# EAGLE design Capstone-Main (EAGLE 9.3.1)
DRAWING_AUTHOR: S.Spencer & E.Fryters; DRAWING_NUMBER: DWG-001; REV: A

## Sheet 1 of 5: MCU Microcontroller specific circuitry
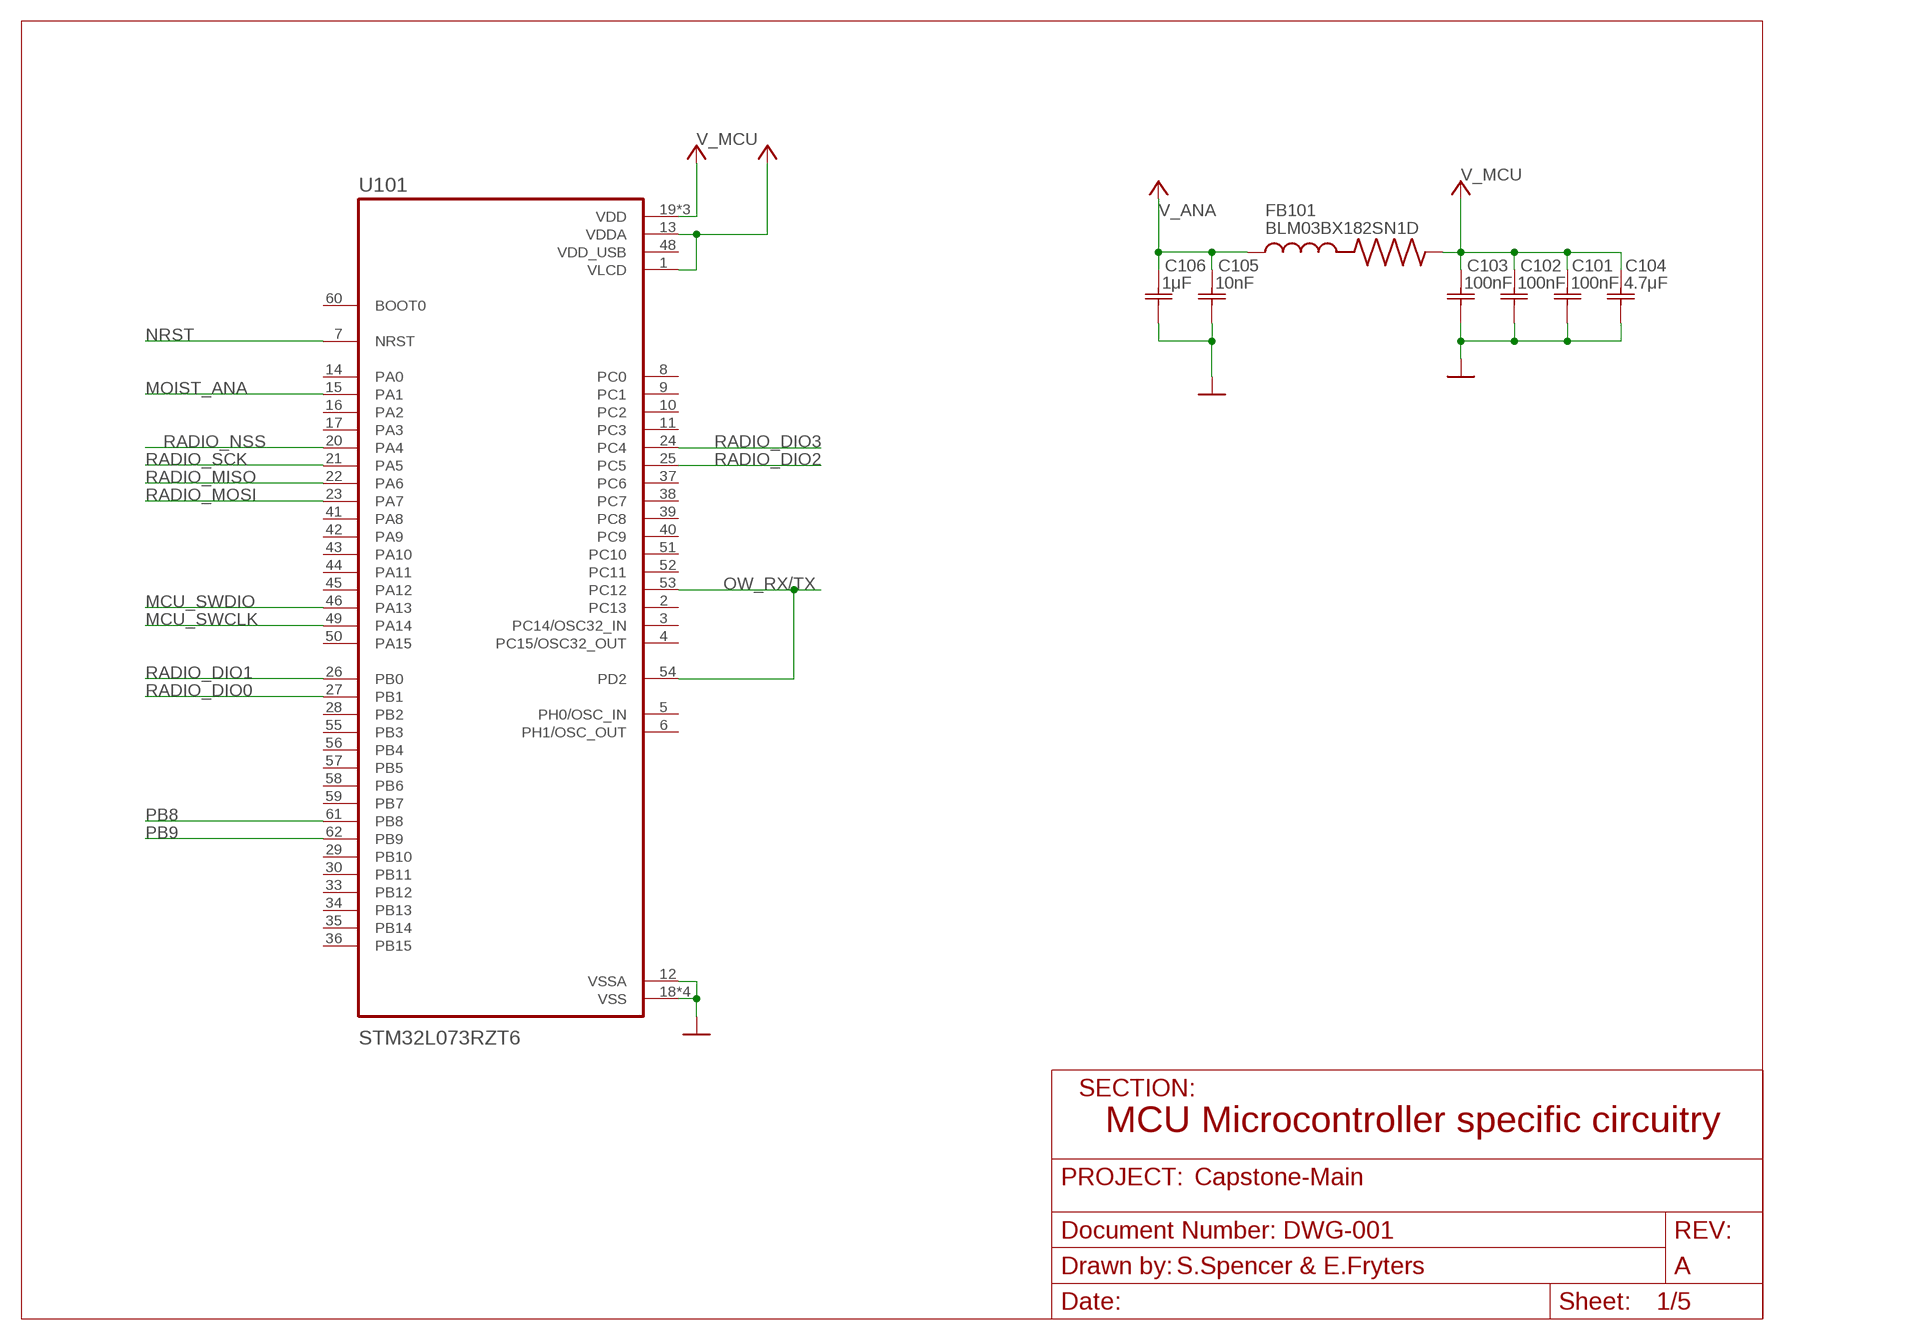
[diagram p0: schematic, sheet 1]

### Parts
C101  100nF  GRM188R71H104KA93D  [CAPC1608X85N]
C102  100nF  GRM188R71H104KA93D  [CAPC1608X85N]
C103  100nF  GRM188R71H104KA93D  [CAPC1608X85N]
C104  4.7μF  GRM188R71H104KA93D  [CAPC1608X85N]
C105  10nF  GRM188R71H104KA93D  [CAPC1608X85N]
C106  1μF  GRM188R71H104KA93D  [CAPC1608X85N]
FB101  BLM03BX182SN1D  [BEADC0603X33N]
U101  STM32L073RZT6  [QFP50P1200X1200X160-64N]

### Nets
GND: C101.1(C1) C102.1(C1) C103.1(C1) C104.1(C1) C105.1(C1) C106.1(C1) U101.12(VSSA) U101.18(VSS) U101.31(VSS) U101.47(VSS) U101.63(VSS) ; also sheet 2,3,4,5
MCU_SWCLK: U101.49(PA14) ; also sheet 4
MCU_SWDIO: U101.46(PA13) ; also sheet 4
MOIST_ANA: U101.15(PA1) ; also sheet 4
NRST: U101.7(NRST) ; also sheet 4
OW_RX/TX: U101.53(PC12) U101.54(PD2) ; also sheet 4
PB8: U101.61(PB8) ; also sheet 4
PB9: U101.62(PB9) ; also sheet 4
RADIO_DIO0: U101.27(PB1) ; also sheet 2
RADIO_DIO1: U101.26(PB0) ; also sheet 2
RADIO_DIO2: U101.25(PC5) ; also sheet 2
RADIO_DIO3: U101.24(PC4) ; also sheet 2
RADIO_MISO: U101.22(PA6) ; also sheet 2
RADIO_MOSI: U101.23(PA7) ; also sheet 2
RADIO_NSS: U101.20(PA4) ; also sheet 2
RADIO_SCK: U101.21(PA5) ; also sheet 2
V_ANA: C105.2(C2) C106.2(C2) FB101.1 U101.1(VLCD) U101.13(VDDA) ; supply symbol labelled VCC
V_MCU: C101.2(C2) C102.2(C2) C103.2(C2) C104.2(C2) FB101.2 U101.19(VDD) U101.32(VDD) U101.64(VDD) ; supply symbol labelled V_3.3, VCC ; also sheet 2,3,4
Unconnected: U101.2(PC13) U101.3(PC14/OSC32_IN) U101.4(PC15/OSC32_OUT) U101.5(PH0/OSC_IN) U101.6(PH1/OSC_OUT) U101.8(PC0) U101.9(PC1) U101.10(PC2) U101.11(PC3) U101.14(PA0) U101.16(PA2) U101.17(PA3) U101.28(PB2) U101.29(PB10) U101.30(PB11) U101.33(PB12) U101.34(PB13) U101.35(PB14) U101.36(PB15) U101.37(PC6) U101.38(PC7) U101.39(PC8) U101.40(PC9) U101.41(PA8) U101.42(PA9) U101.43(PA10) U101.44(PA11) U101.45(PA12) U101.50(PA15) U101.51(PC10) U101.52(PC11) U101.55(PB3) U101.56(PB4) U101.57(PB5) U101.58(PB6) U101.59(PB7) U101.60(BOOT0)

## Sheet 2 of 5: SX1272 / Radio Radio circuitry here
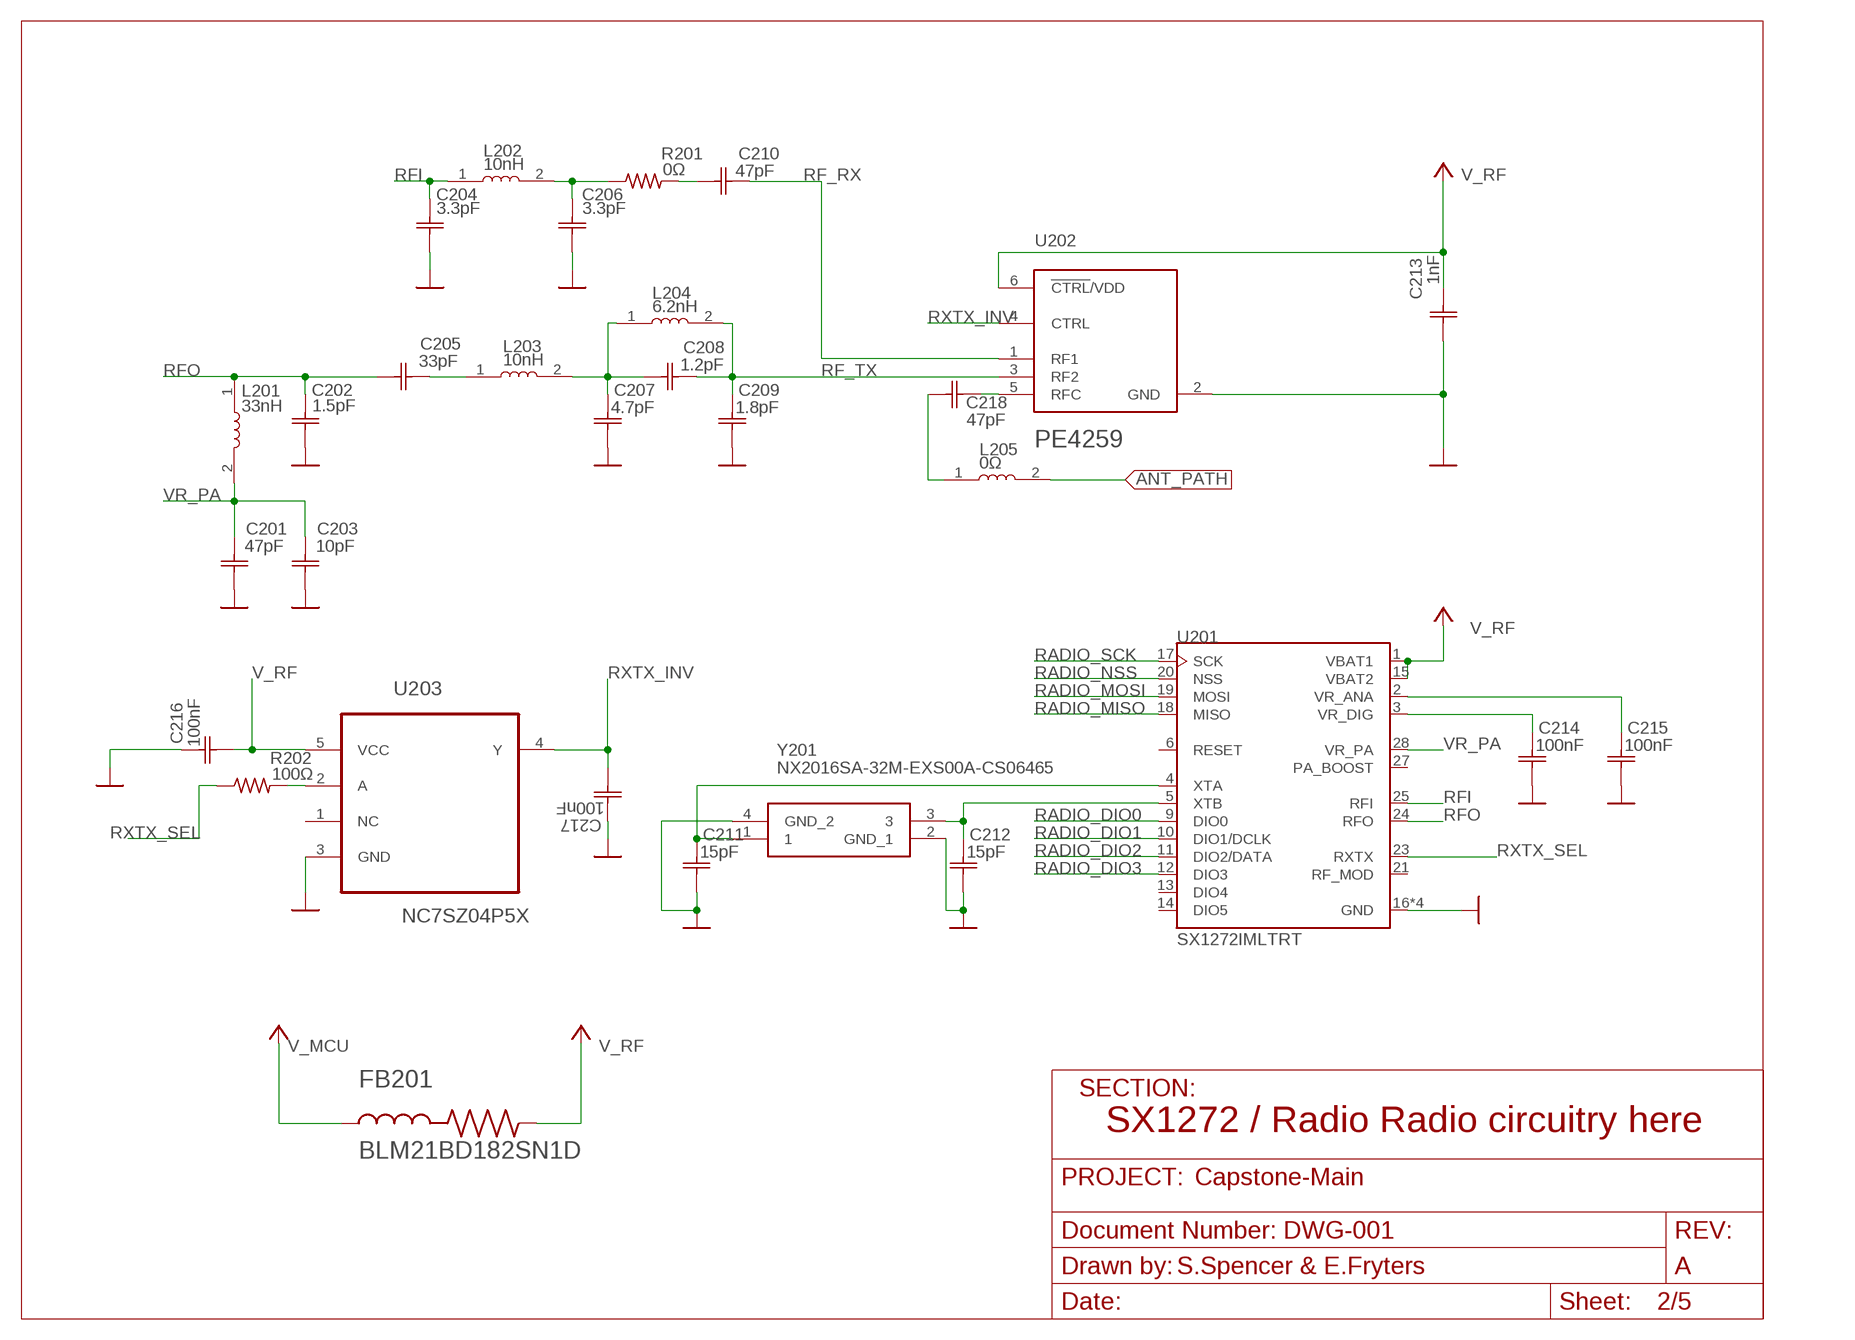
[diagram p1: schematic, sheet 2]

### Parts
C201  47pF  GRM188R71H104KA93D  [CAPC1608X85N]
C202  1.5pF  GRM188R71H104KA93D  [CAPC1608X85N]
C203  10pF  GRM188R71H104KA93D  [CAPC1608X85N]
C204  3.3pF  GRM188R71H104KA93D  [CAPC1608X85N]
C205  33pF  GRM188R71H104KA93D  [CAPC1608X85N]
C206  3.3pF  GRM188R71H104KA93D  [CAPC1608X85N]
C207  4.7pF  GRM188R71H104KA93D  [CAPC1608X85N]
C208  1.2pF  GRM188R71H104KA93D  [CAPC1608X85N]
C209  1.8pF  GRM188R71H104KA93D  [CAPC1608X85N]
C210  47pF  GRM188R71H104KA93D  [CAPC1608X85N]
C211  15pF  GRM188R71H104KA93D  [CAPC1608X85N]
C212  15pF  GRM188R71H104KA93D  [CAPC1608X85N]
C213  1nF  GRM188R71H104KA93D  [CAPC1608X85N]
C214  100nF  GRM188R71H104KA93D  [CAPC1608X85N]
C215  100nF  GRM188R71H104KA93D  [CAPC1608X85N]
C216  100nF  GRM188R71H104KA93D  [CAPC1608X85N]
C217  100nF  GRM188R71H104KA93D  [CAPC1608X85N]
C218  47pF  GRM188R71H104KA93D  [CAPC1608X85N]
FB201  BLM21BD182SN1D  [BEADC2012X105N]
L201  33nH  LQP03TG1N0C02D  [INDC1608X95]
L202  10nH  LQP03TG1N0C02D  [INDC1608X95]
L203  10nH  LQP03TG1N0C02D  [INDC1608X95]
L204  6.2nH  LQP03TG1N0C02D  [INDC1608X95]
L205  0Ω  LQP03TG1N0C02D  [INDC1608X95]
R201  0Ω  R-US_R0603  [R0603]
R202  100Ω  R-US_R0603  [R0603]
U201  SX1272IMLTRT  [QFN65P600X600X100-29N]
U202  PEREGRINE_SEMICONDUCTOR_PE4259PEREGRINE_SEMICONDUCTOR_PE4259_0_0  [PEREGRINE_SEMICONDUCTOR_PE4259_0]
U203  NC7SZ04P5X  [SOT65P210X110-5N]
Y201  NX2016SA-32M-EXS00A-CS06465  [NX2016SA32MEXS00ACS06465]

### Nets
ANT_PATH: L205.2 ; also sheet 5
GND: C201.1(C1) C202.2(C2) C203.1(C1) C204.2(C2) C206.2(C2) C207.2(C2) C209.2(C2) C211.2(C2) C212.2(C2) C213.2(C2) C214.2(C2) C215.2(C2) C216.1(C1) C217.1(C1) U201.16(GND) U201.22(GND) U201.26(GND) U201.29(GND) U202.2(GND) U203.3(GND) Y201.2(GND_1) Y201.4(GND_2) ; also sheet 1,3,4,5
N$1: C214.1(C1) U201.3(VR_DIG)
N$2: C215.1(C1) U201.2(VR_ANA)
N$3: C211.1(C1) U201.4(XTA) Y201.1
N$5: C206.1(C1) L202.2 R201.1
N$7: C210.2(C2) R201.2
N$10: C212.1(C1) U201.5(XTB) Y201.3
N$14: C205.1(C1) L203.1
N$15: C207.1(C1) C208.1(C1) L203.2 L204.1
N$19: R202.2 U203.2(A)
N$20: C218.2(C2) U202.5(RFC)
N$21: C218.1(C1) L205.1
RADIO_DIO0: U201.9(DIO0) ; also sheet 1
RADIO_DIO1: U201.10(DIO1/DCLK) ; also sheet 1
RADIO_DIO2: U201.11(DIO2/DATA) ; also sheet 1
RADIO_DIO3: U201.12(DIO3) ; also sheet 1
RADIO_MISO: U201.18(MISO) ; also sheet 1
RADIO_MOSI: U201.19(MOSI) ; also sheet 1
RADIO_NSS: U201.20(NSS) ; also sheet 1
RADIO_SCK: U201.17(SCK) ; also sheet 1
RF_RX: C210.1(C1) U202.1(RF1)
RF_TX: C208.2(C2) C209.1(C1) L204.2 U202.3(RF2)
RFI: C204.1(C1) L202.1 U201.25(RFI)
RFO: C202.1(C1) C205.2(C2) L201.1 U201.24(RFO)
RXTX_INV: C217.2(C2) U202.4(CTRL) U203.4(Y)
RXTX_SEL: R202.1 U201.23(RXTX)
V_MCU: FB201.1 ; supply symbol labelled VCC ; also sheet 1,3,4
V_RF: C213.1(C1) C216.2(C2) FB201.2 U201.1(VBAT1) U201.15(VBAT2) U202.6(!CTRL!/VDD) U203.5(VCC) ; supply symbol labelled VCC
VR_PA: C201.2(C2) C203.2(C2) L201.2 U201.28(VR_PA)
Unconnected: U201.6(RESET) U201.13(DIO4) U201.14(DIO5) U201.21(RF_MOD) U201.27(PA_BOOST) U203.1(NC)

## Sheet 3 of 5: Power Circuitry to handle power and power distribution
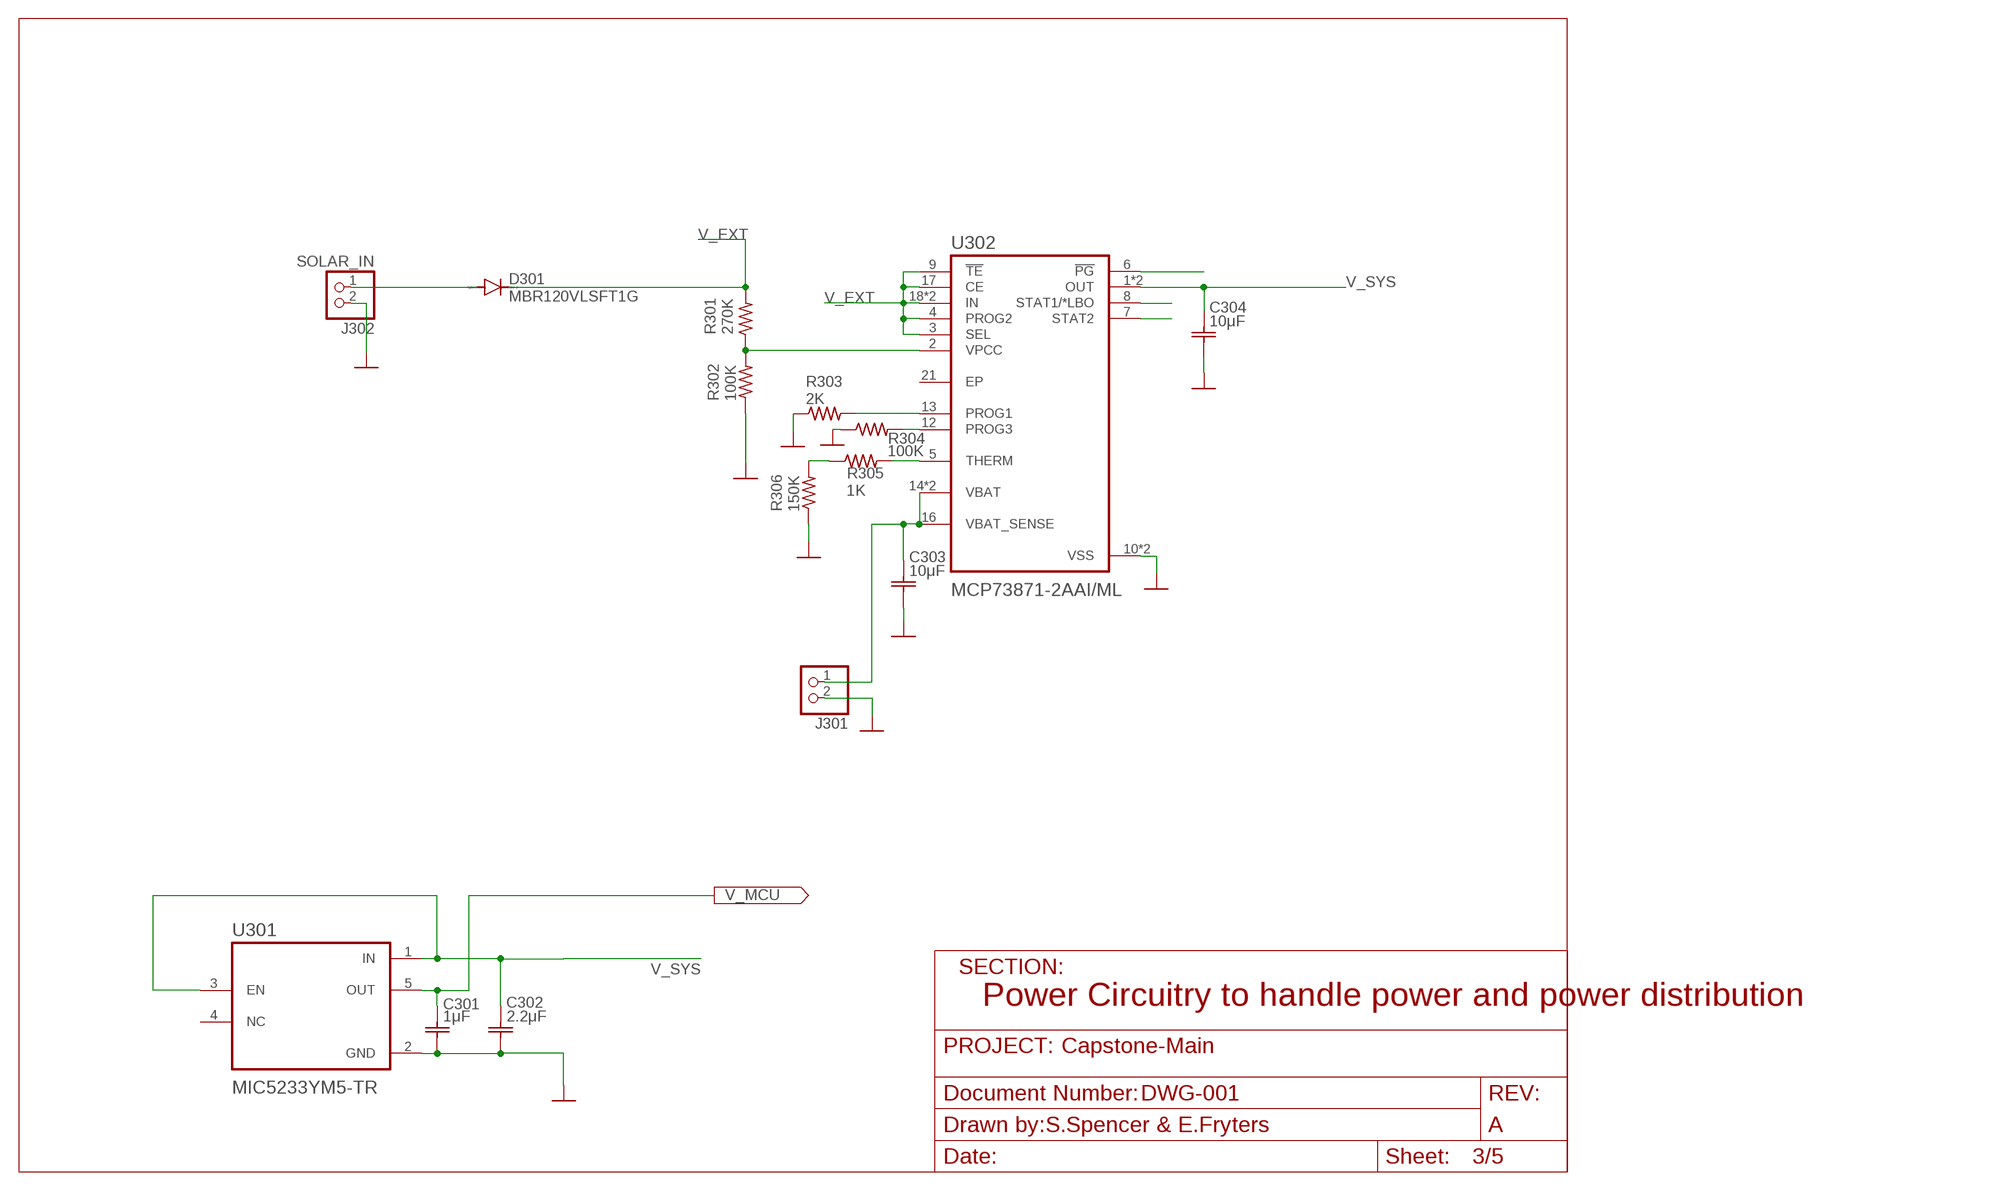
[diagram p2: schematic, sheet 3]

### Parts
C301  1μF  GRM188R71H104KA93D  [CAPC1608X85N]
C302  2.2μF  GRM188R71H104KA93D  [CAPC1608X85N]
C303  10μF  GRM188R71H104KA93D  [CAPC1608X85N]
C304  10μF  GRM188R71H104KA93D  [CAPC1608X85N]
D301  MBR120VLSFT1G  CGRM4001-G  [SOD-123_MINI-SMA]
J301  JST_2PIN-SMT-RA  [JST-PH-2-SMT-RA]
J302  SOLAR_IN  JST_2PIN-SMT-RA  [JST-PH-2-SMT-RA]
R301  270K  R-US_R0603  [R0603]
R302  100K  R-US_R0603  [R0603]
R303  2K  R-US_R0603  [R0603]
R304  100K  R-US_R0603  [R0603]
R305  1K  R-US_R0603  [R0603]
R306  150K  R-US_R0603  [R0603]
U301  MIC5233YM5-TR  [SOT95P280X145-5N]
U302  MCP73871-2AAI/ML  [QFN50P400X400X100-21N]

### Nets
GND: C301.2(C2) C302.2(C2) C303.2(C2) C304.2(C2) J301.2 J302.2 R302.1 R303.1 R304.1 R306.1 U301.2(GND) U302.10(VSS) U302.11(VSS) ; also sheet 1,2,4,5
N$4: R301.1 R302.2 U302.2(VPCC)
N$6: R304.2 U302.12(PROG3)
N$8: R303.2 U302.13(PROG1)
N$11: C303.1(C1) J301.1 U302.14(VBAT) U302.15(VBAT) U302.16(VBAT_SENSE)
N$12: R305.1 R306.2
N$13: R305.2 U302.5(THERM)
N$16: U302.6(!PG)
N$17: U302.8(STAT1/*LBO)
N$18: U302.7(STAT2)
N$23: D301.A J302.1
V_EXT: D301.C R301.2 U302.3(SEL) U302.4(PROG2) U302.9(!TE) U302.17(CE) U302.18(IN) U302.19(IN) ; also sheet 4
V_MCU: C301.1(C1) U301.5(OUT) ; also sheet 1,2,4
V_SYS: C302.1(C1) C304.1(C1) U301.1(IN) U301.3(EN) U302.1(OUT) U302.20(OUT)
Unconnected: U301.4(NC) U302.21(EP)

## Sheet 4 of 5: Mechanical / Connectors Contains all connector revelant symbols</p?
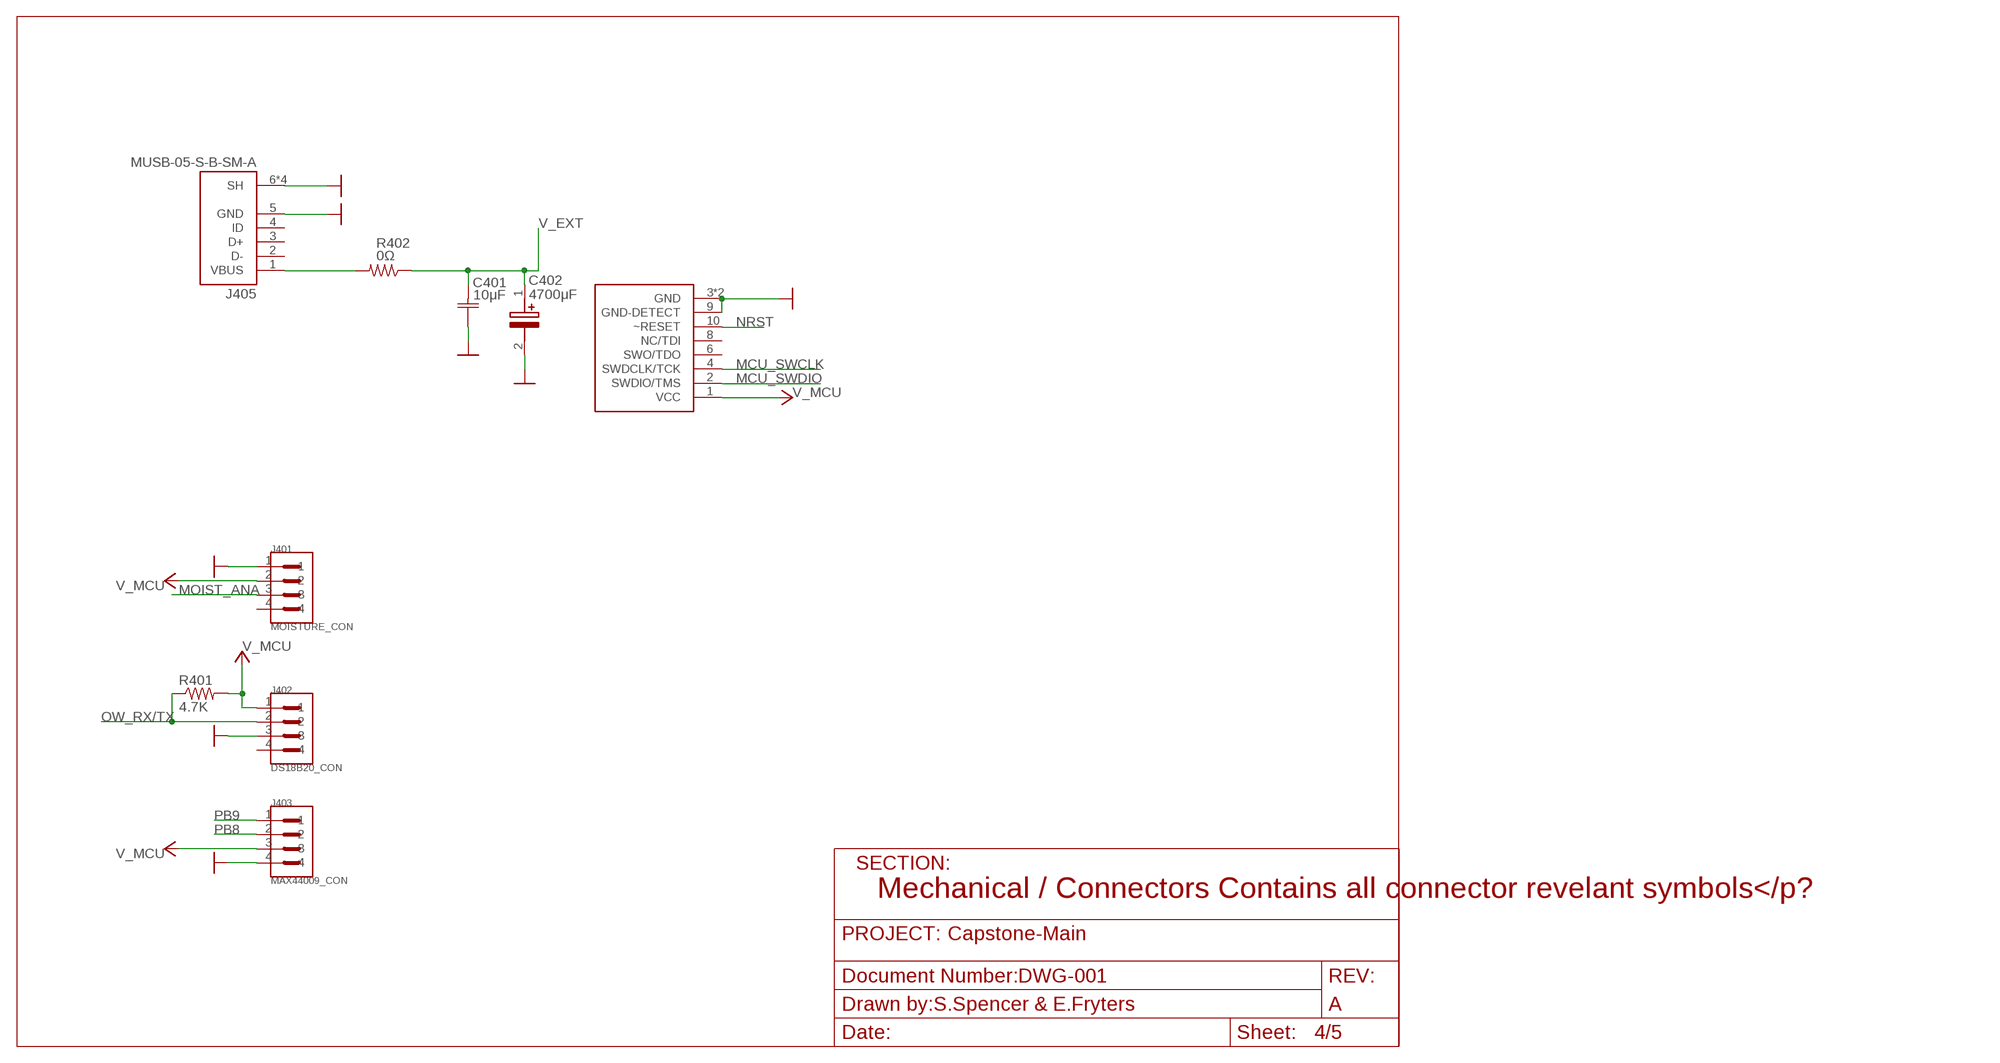
[diagram p3: schematic, sheet 4]

### Parts
C401  10μF  GRM188R71H103KA01D  [CAPC1608X85N]
C402  4700μF  EEV-FK1A472M  [CAPAE1700X1700N]
J401  MOISTURE_CON  B4B-PH-SM4-TB  [JST_B4B-PH-SM4-TB]
J402  DS18B20_CON  B4B-PH-SM4-TB  [JST_B4B-PH-SM4-TB]
J403  MAX44009_CON  B4B-PH-SM4-TB  [JST_B4B-PH-SM4-TB]
J404  2X5_0.05"_CORTEX_DEBUGSMD_SHROUDED  [2X5_0.05"_SMD_SH]
J405  MUSB-05-S-B-SM-A  [SAMTEC_MUSB-05-S-B-SM-A]
R401  4.7K  R-US_R0603  [R0603]
R402  0Ω  R-US_R0603  [R0603]

### Nets
GND: C401.1(C1) C402.2(-) J401.1 J402.3 J403.4 J404.3(GND) J404.5(GND) J404.9(GND-DETECT) J405.5(GND) J405.6(SH) J405.7(SH) J405.8(SH) J405.9(SH) ; also sheet 1,2,3,5
MCU_SWCLK: J404.4(SWDCLK/TCK) ; also sheet 1
MCU_SWDIO: J404.2(SWDIO/TMS) ; also sheet 1
MOIST_ANA: J401.3 ; also sheet 1
N$9: J405.1(VBUS) R402.2
NRST: J404.10(~RESET) ; also sheet 1
OW_RX/TX: J402.2 R401.1 ; also sheet 1
PB8: J403.2 ; also sheet 1
PB9: J403.1 ; also sheet 1
V_EXT: C401.2(C2) C402.1(+) R402.1 ; also sheet 3
V_MCU: J401.2 J402.1 J403.3 J404.1(VCC) R401.2 ; supply symbol labelled VCC ; also sheet 1,2,3
Unconnected: J401.4 J402.4 J404.6(SWO/TDO) J404.8(NC/TDI) J405.2(D-) J405.3(D+) J405.4(ID)

## Sheet 5 of 5: Antenna
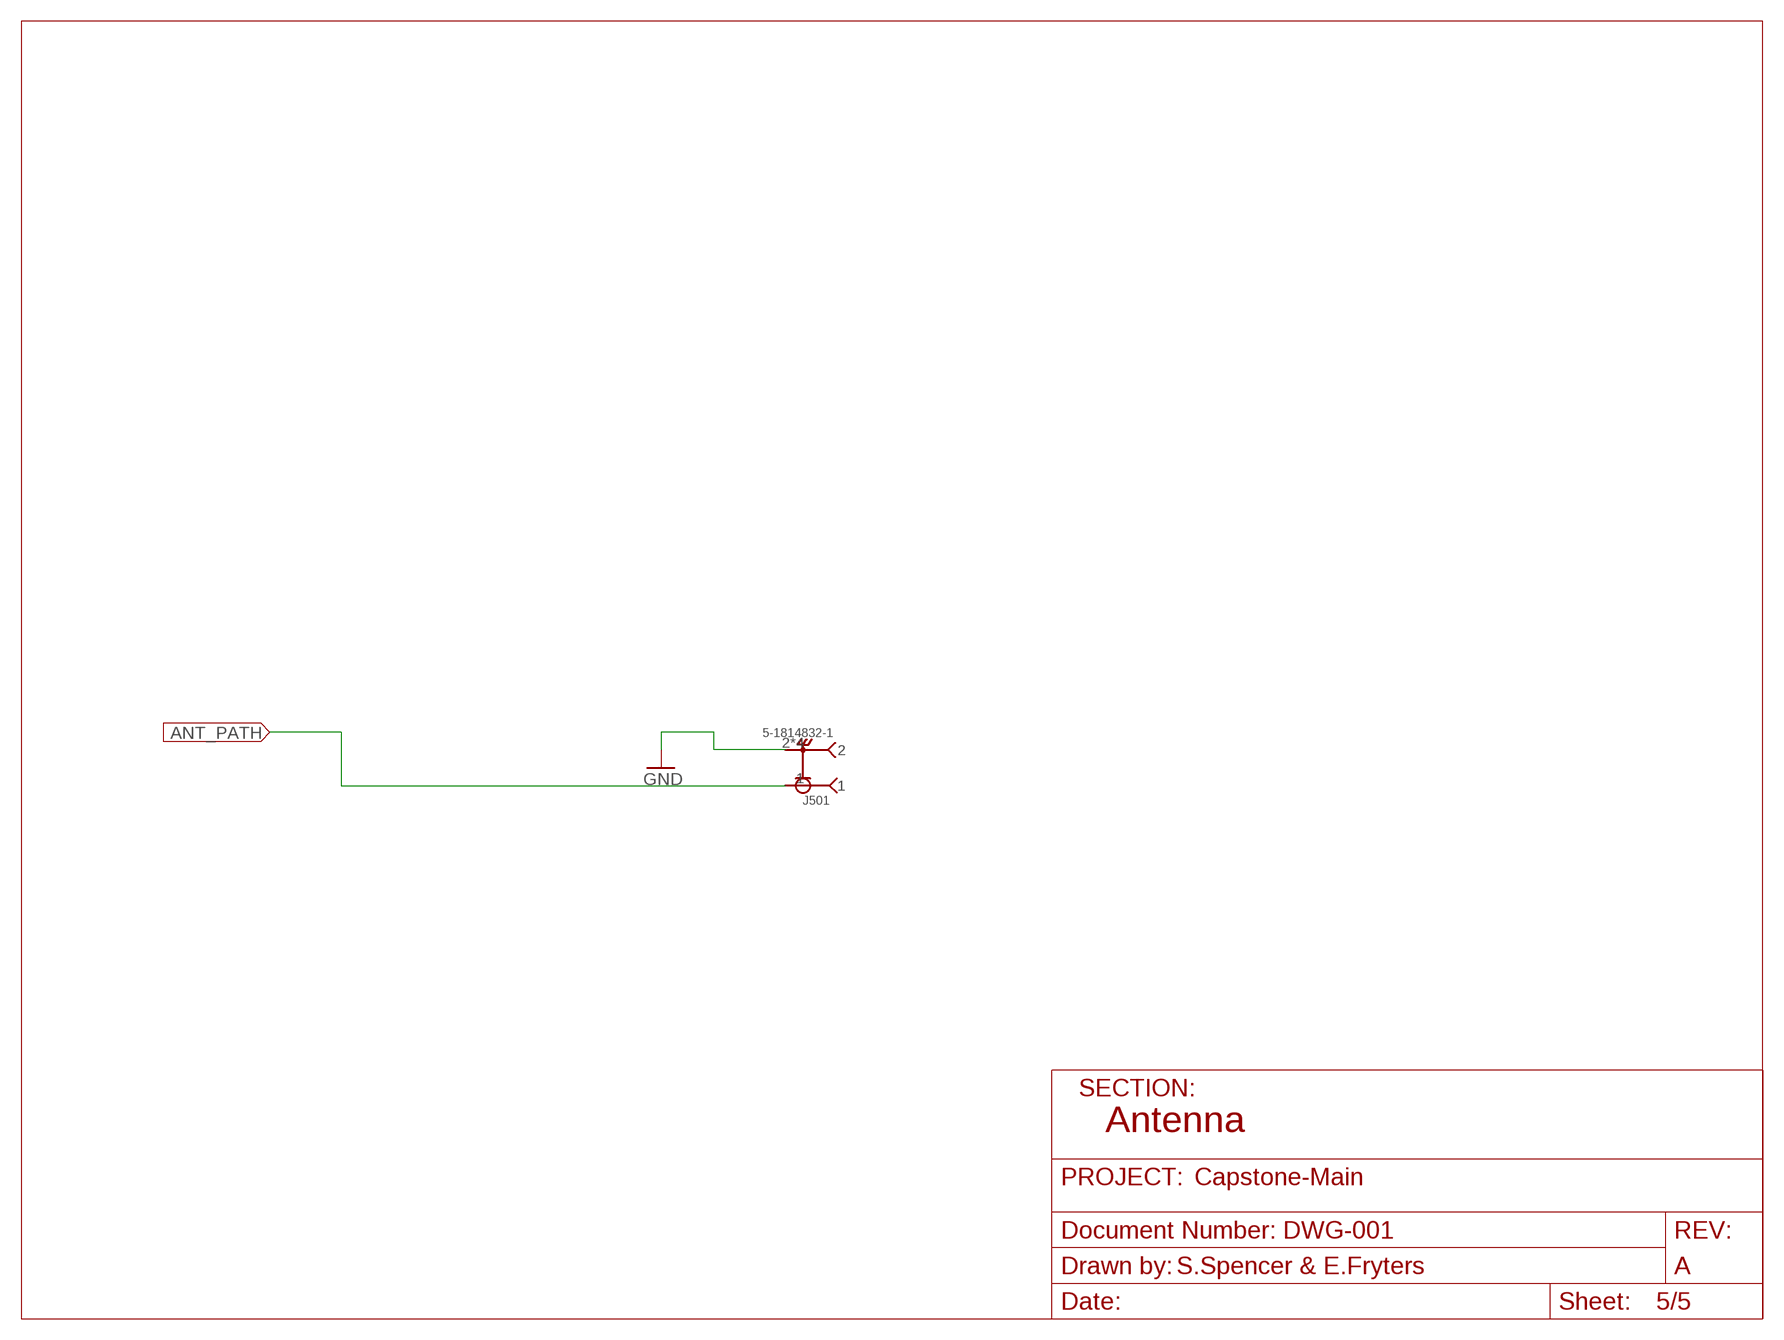
[diagram p4: schematic, sheet 5]

### Parts
J501  5-1814832-1  [TE_5-1814832-1]

### Nets
ANT_PATH: J501.1 ; also sheet 2
GND: J501.2 J501.3 J501.4 J501.5 ; also sheet 1,2,3,4

## Power pins joined to a net without a drawn wire
VDD_USB: U101.48(VDD_USB)

## Library data of the parts
C101-C103 C214-C217 = Murata_By_element14_Batch_1:GRM188R71H104KA93D: CAPACITOR, 0603; MPN: GRM188R71H104KA93D; OC_FARNELL: 8820023; OC_NEWARK: 38K1670; SUPPLIER: Murata; TOLERANCE: ±10%; VOLTAGERATING: 50V
C104-C106 C201-C213 C218 C301-C304 = Murata_By_element14_Batch_1:GRM188R71H104KA93D: CAPACITOR, 0603; MPN: GRM188R71H104KA93D; OC_FARNELL: 8820023; OC_NEWARK: 38K1670; SUPPLIER: Murata; TOLERANCE: ±10%; VALUE: 100nF; VOLTAGERATING: 50V
C401 = Murata_By_element14_Batch_1:GRM188R71H103KA01D: CAPACITOR, 0603; MPN: GRM188R71H103KA01D; OC_FARNELL: 8819980; OC_NEWARK: 97K0612; SUPPLIER: Murata; TOLERANCE: ±10%; VALUE: 10nF; VOLTAGERATING: 50V
C402 = SamacSys_Parts:EEV-FK1A472M: Aluminum Electrolytic Capacitors - SMD 4700uF 10V Source: Datasheet <https://componentsearchengine.com/Datasheets/1/EEV-FK1A472M.pdf>; DESCRIPTION: Aluminum Electrolytic Capacitors - SMD 4700uF 10V; HEIGHT: 17mm; MANUFACTURER_NAME: Panasonic; MANUFACTURER_PART_NUMBER: EEV-FK1A472M; MOUSER_PART_NUMBER: 667-EEV-FK1A472M; MOUSER_PRICE-STOCK: https://www.mouser.com/Search/Refine.aspx?Keyword=667-EEV-FK1A472M
D301 = diode:CGRM400*-G: Molded plasitc,JEDEC SOD-123/Mini SMA Source: Comchip CGRM4001-G.pdf
FB101 = BLM03BX182SN1D:BLM03BX182SN1D: FERRITE BEAD 1.8 KOHM 0201 1LN; AVAILABILITY: Unavailable; DESCRIPTION: Ferrite Beads Multi-Layer 1.8KOhm 25% 100MHz 140mA 2.5Ohm DCR 0201 Automotive T/R; MF: Murata; MP: BLM03BX182SN1D; PACKAGE: 0603 Murata; PRICE: None
FB201 = BLM21BD182SN1D:BLM21BD182SN1D: SMD ferrite bead 1800 Ω (L x W x H) 2 x 1.25 x 1.25 mm Murata BLM21BD182SN1D 4000 pc(s); DESCRIPTION: SMD EMI Filters/Chip Ferrite Beads 0805, 1.8Kohms, HiSpd Signal Line, Tape; DIGI-KEY_PART_NUMBER: 490-1049-1-ND; DIGI-KEY_PURCHASE_URL: https://www.digikey.ca/product-detail/en/murata-electronics/BLM21BD182SN1D/490-1049-1-ND/584496?utm_source=snapeda&utm_medium=aggregator&utm_campaign=symbol; MF: Murata; MP: BLM21BD182SN1D; PACKAGE: 2012 Murata
J301 J302 = adafruit:JST_2PIN: JST 2-Pin Connectors of various flavors SMT-RA (S2B-PH-SM4) 4UConnector #17311 SMT (B2B-PH-SM4) THM-RA (S2B-PH) THM (B2B-PH)
J401-J403 = B4B-PH-SM4-TB:B4B-PH-SM4-TB: CONN HEADER PH TOP 4POS 2MM SMD; AVAILABILITY: Unavailable; DESCRIPTION: Socket; wire-board; male; PIN: 4; 2mm; SMT; PH; 100V; 2A; MF: JST Sales; MP: B4B-PH-SM4-TB; PACKAGE: None; PRICE: None
J404 = con-cortex:2X5_0.05"_CORTEX_DEBUG
J405 = MUSB-05-S-B-SM-A:MUSB-05-S-B-SM-A: CONN RECEPT USB MINI B SMD R/A; AVAILABILITY: Unavailable; DESCRIPTION: USB - mini B USB 2.0 Receptacle Connector 5 Position Surface Mount, Right Angle; MF: Samtec; MP: MUSB-05-S-B-SM-A; PACKAGE: None; PRICE: None
J501 = SMA-FEMALE_PTH:5-1814832-1: SMA Str PCB Skt GZD; DESCRIPTION: SMA Connector Jack, Female Socket 50Ohm Through Hole Solder; DIGI-KEY_PART_NUMBER: A97594-ND; DIGI-KEY_PURCHASE_URL: https://www.digikey.ca/product-detail/en/te-connectivity-amp-connectors/5-1814832-1/A97594-ND/1755982?utm_source=snapeda&utm_medium=aggregator&utm_campaign=symbol; MF: TE Connectivity; MP: 518148321; PACKAGE: None; TE_PURCHASE_URL: https://www.te.com/usa-en/product-518148321.html?te_bu=Cor&te_type=disp&te_campaign=seda_glo_cor-seda-global-disp-prtnr-fy19-seda-model-bom-cta_sma-317_1&elqCampaignId=32493
L201-L205 = LQP03TG1N0C02D:LQP03TG1N0C02D: 0201 (0603) 1.0NH 0.2NH 600MA 0.; AVAILABILITY: Unavailable; DESCRIPTION: 0201 _0603_ 1.0nh 0.2nh 600ma 0.; MF: Murata; MP: LQP03TG1N0C02D; PACKAGE: 0603 Murata; PRICE: None
R201 R202 R301-R306 R401 R402 = rcl:R-US_: RESISTOR, American symbol; SPICEPREFIX: R
U101 = STM32L073RZT6:STM32L073RZT6: None; AVAILABILITY: Unavailable; DESCRIPTION: Ultra-low-power ARM Cortex-M0+ MCU with 192 Kbytes Flash, 32 MHz CPU, USB, LCD; MF: STMicroelectronics; MP: STM32L073RZT6; PACKAGE: LQFP-64 STMicroelectronics; PRICE: None
U201 = SX1272IMLTRT:SX1272IMLTRT: SX1272 Series 860-1020 MHz 300 kbps Low Power Long Range Transceiver - QFN-28EP; AVAILABILITY: Unavailable; DESCRIPTION: SX1272 Series 860-1020 MHz 300 kbps Low Power Long Range Transceiver - QFN-28EP; MF: Semtech; MP: SX1272IMLTRT; PACKAGE: VQFN-28 Semtech; PRICE: None
U202 = Peregrine Semiconductor - PE4259:PEREGRINE_SEMICONDUCTOR_PE4259: RF Switch IC General Purpose SPDT 3GHz 50 Ohm SC-70-6; CENTROID_NOT_SPECIFIED: No; DATASHEET: http://www.psemi.com/pdf/datasheets/pe4259ds.pdf; DIGIKEY_DESCRIPTION: IC RF SWITCH SPDT 50 OHM SC70-6; DIGIKEY_PART_NUMBER: 1046-1011-2-ND; LEAD_FREE: yes; MF: Peregrine Semiconductor; MFG_PACKAGE_IDENT: DOC-76316; MPN: PE4259; OPERATION_FREQUENCY_(MAX): 3GHz; OPERATION_FREQUENCY_(MIN): 10MHz; PACKAGE: SC-70-6; POWER_SUPPLY_CURRENT_(MAX): 20μA; POWER_SUPPLY_VOLTAGE_(MAX): 3.3V; POWER_SUPPLY_VOLTAGE_(MIN): 1.8V; PREFIX: U; ROHS: yes; TEMPERATURE_RANGE_HIGH: 85°C; TEMPERATURE_RANGE_LOW: -40°C; VOLTAGE: 3V
U203 = NC7SZ04P5X:NC7SZ04P5X: Inverter; AVAILABILITY: Unavailable; DESCRIPTION: Inverter IC 1 Channel SC-70-5; MF: ON Semiconductor; MP: NC7SZ04P5X; PACKAGE: SC-70 ON Semiconductor; PRICE: None
U301 = MIC5233YM5-TR:MIC5233YM5-TR: None; AVAILABILITY: Unavailable; DESCRIPTION: MIC5233 Series 100 mA ADJ Output Voltage Low IQ µCap LDO Regulator-SOT-23-5; MF: Microchip; MP: MIC5233YM5-TR; PACKAGE: SOT-23 Microchip; PRICE: None
U302 = MCP73871-2AAI_ML:MCP73871-2AAI/ML; AVAILABILITY: Unavailable; DESCRIPTION: Charger IC Lithium Ion/Polymer 20-QFN _4x4_; MF: Microchip; MP: MCP73871-2AAI/ML; PACKAGE: QFN-20 Microchip; PRICE: None
Y201 = SamacSys_Parts:NX2016SA-32M-EXS00A-CS06465: CRYSTAL 32MHZ 10PF SMD Source: Datasheet <https://componentsearchengine.com/Datasheets/1/NX2016SA-32M-EXS00A-CS06465.pdf>; DESCRIPTION: CRYSTAL 32MHZ 10PF SMD; HEIGHT: 0mm; MANUFACTURER_NAME: NDK; MANUFACTURER_PART_NUMBER: NX2016SA-32M-EXS00A-CS06465; MOUSER_PART_NUMBER: 344-NX2016SA32S06465; MOUSER_PRICE-STOCK: https://www.mouser.com/Search/Refine.aspx?Keyword=344-NX2016SA32S06465

## Net classes
1 GND: width 0.45 mm, drill 0.2 mm

## Board
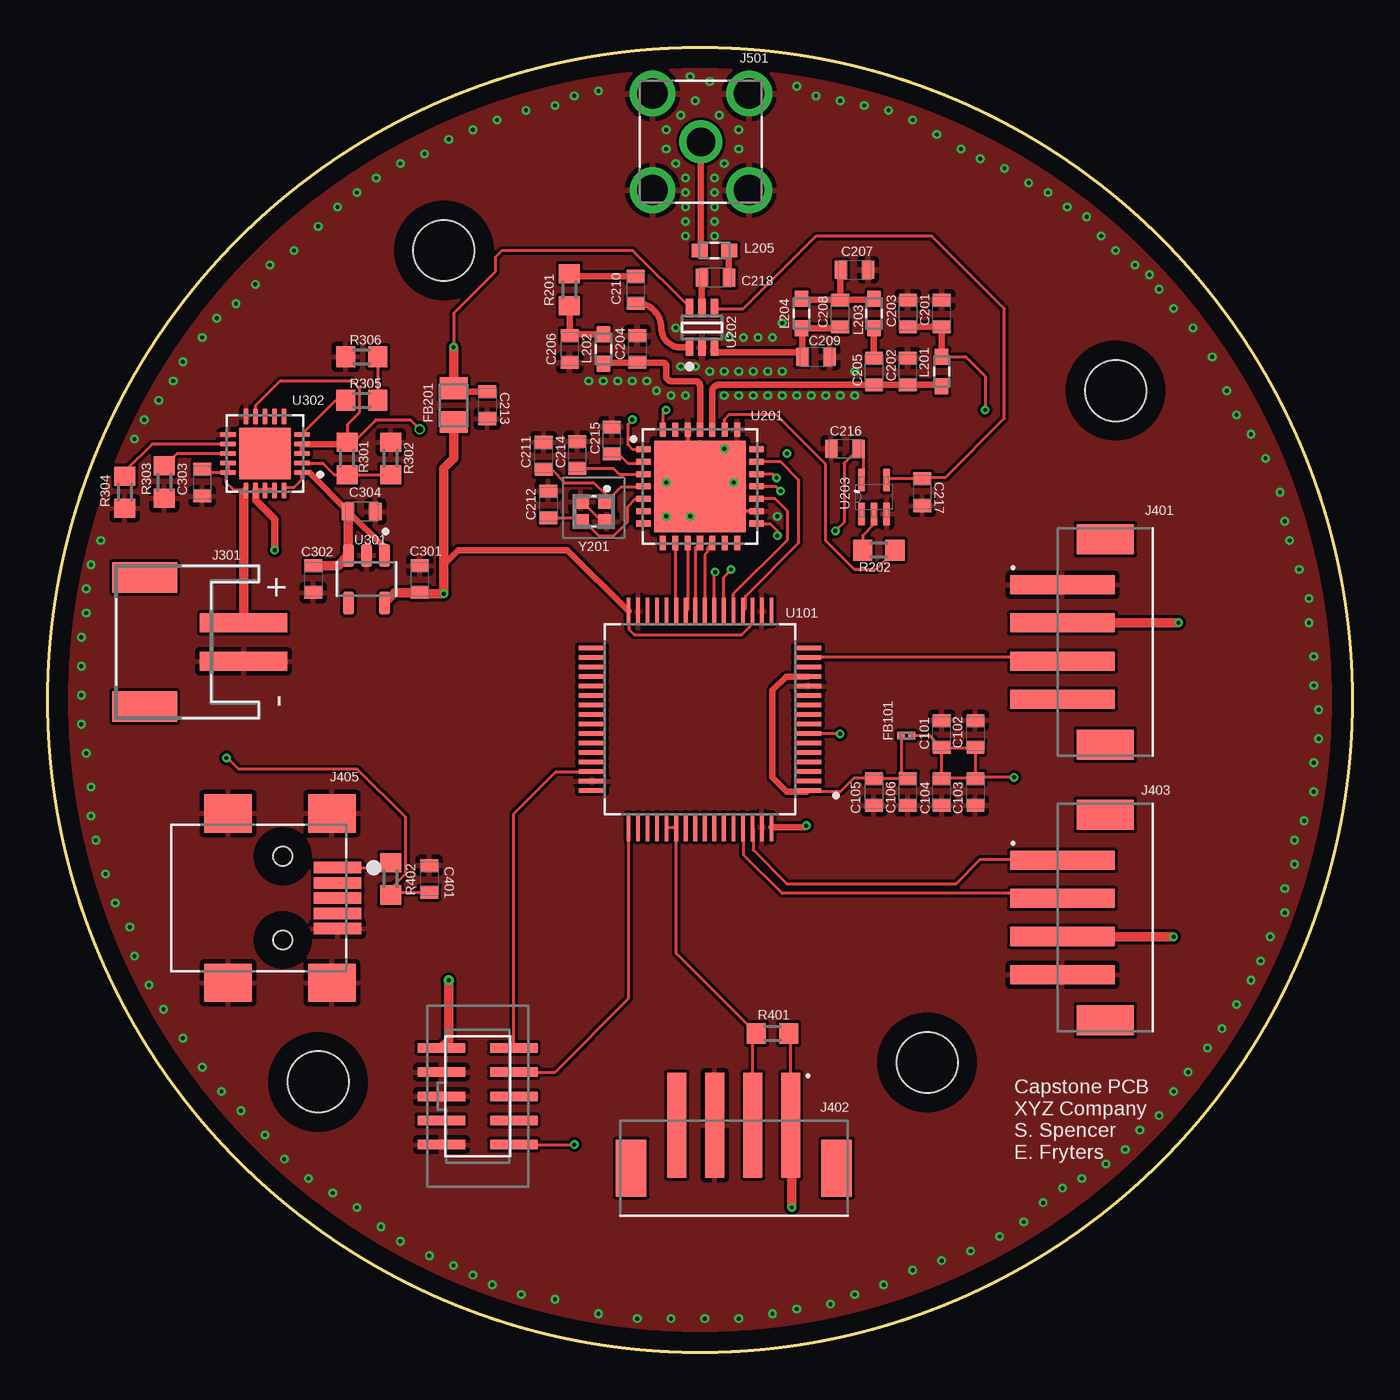
[diagram p5: board, top side]
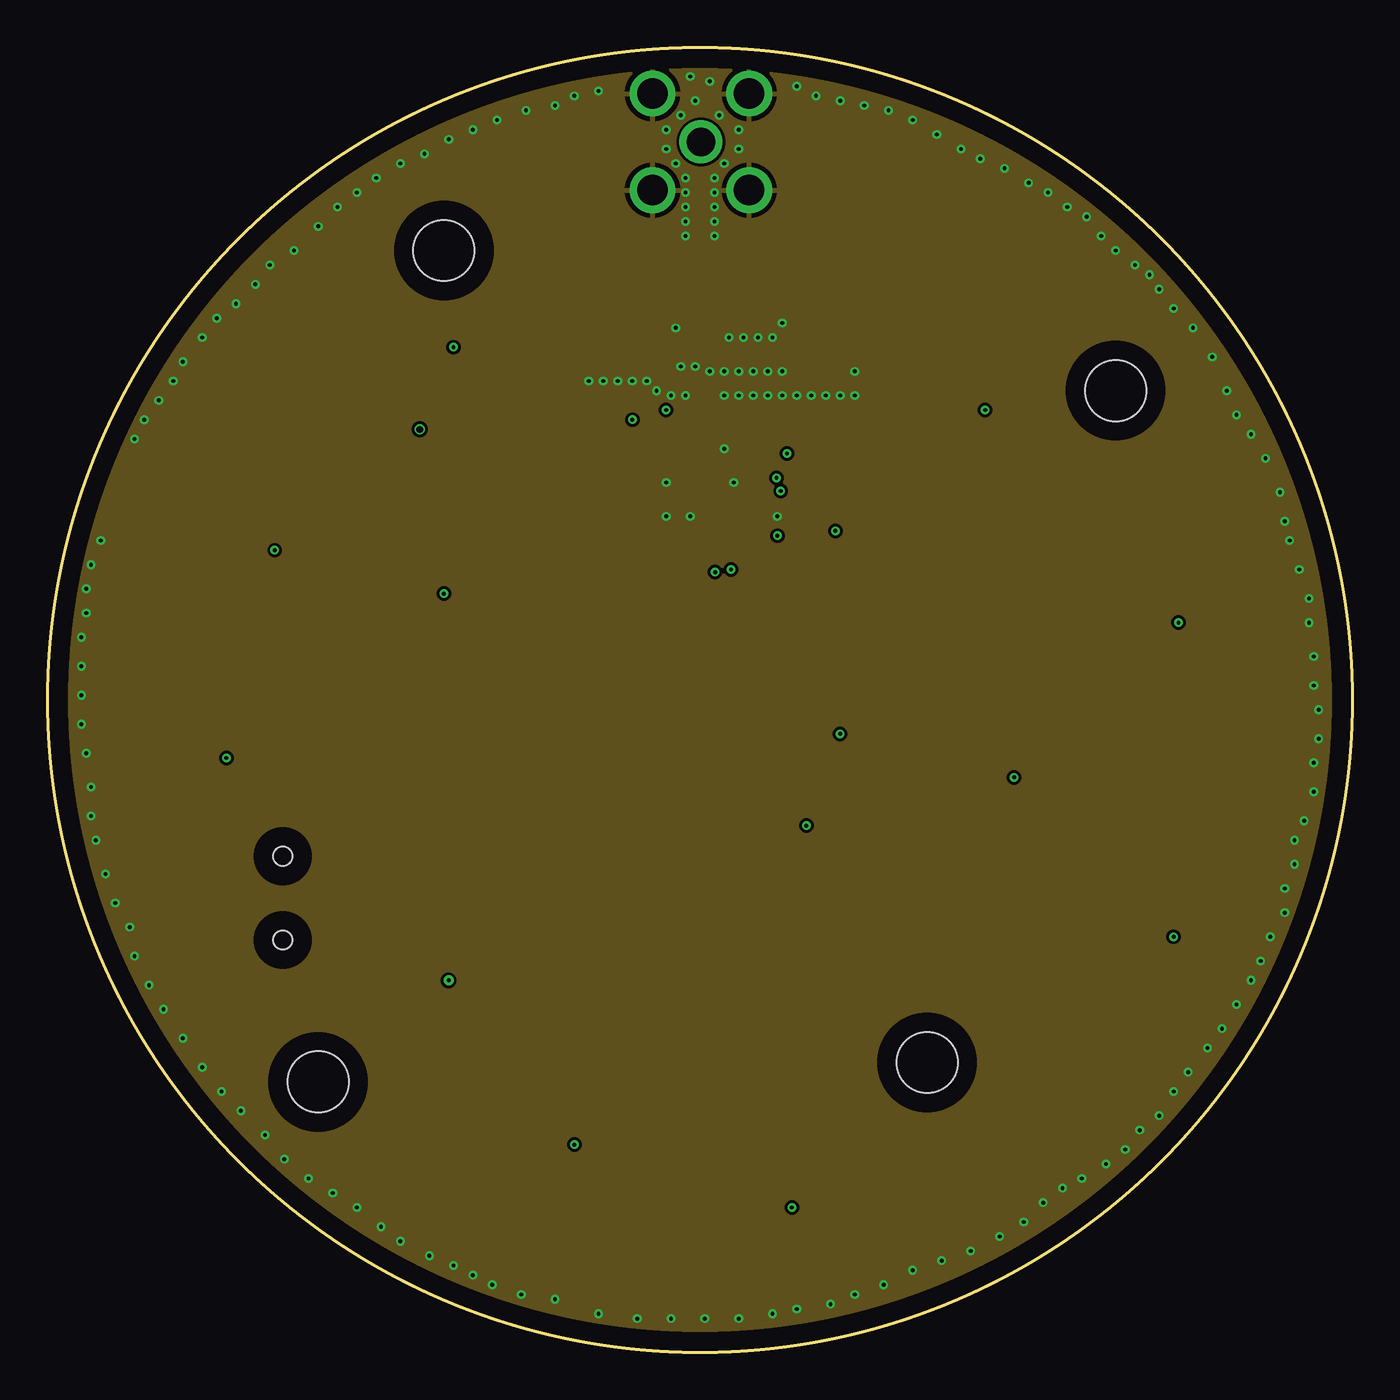
[diagram p6: board, inner layer GND1]
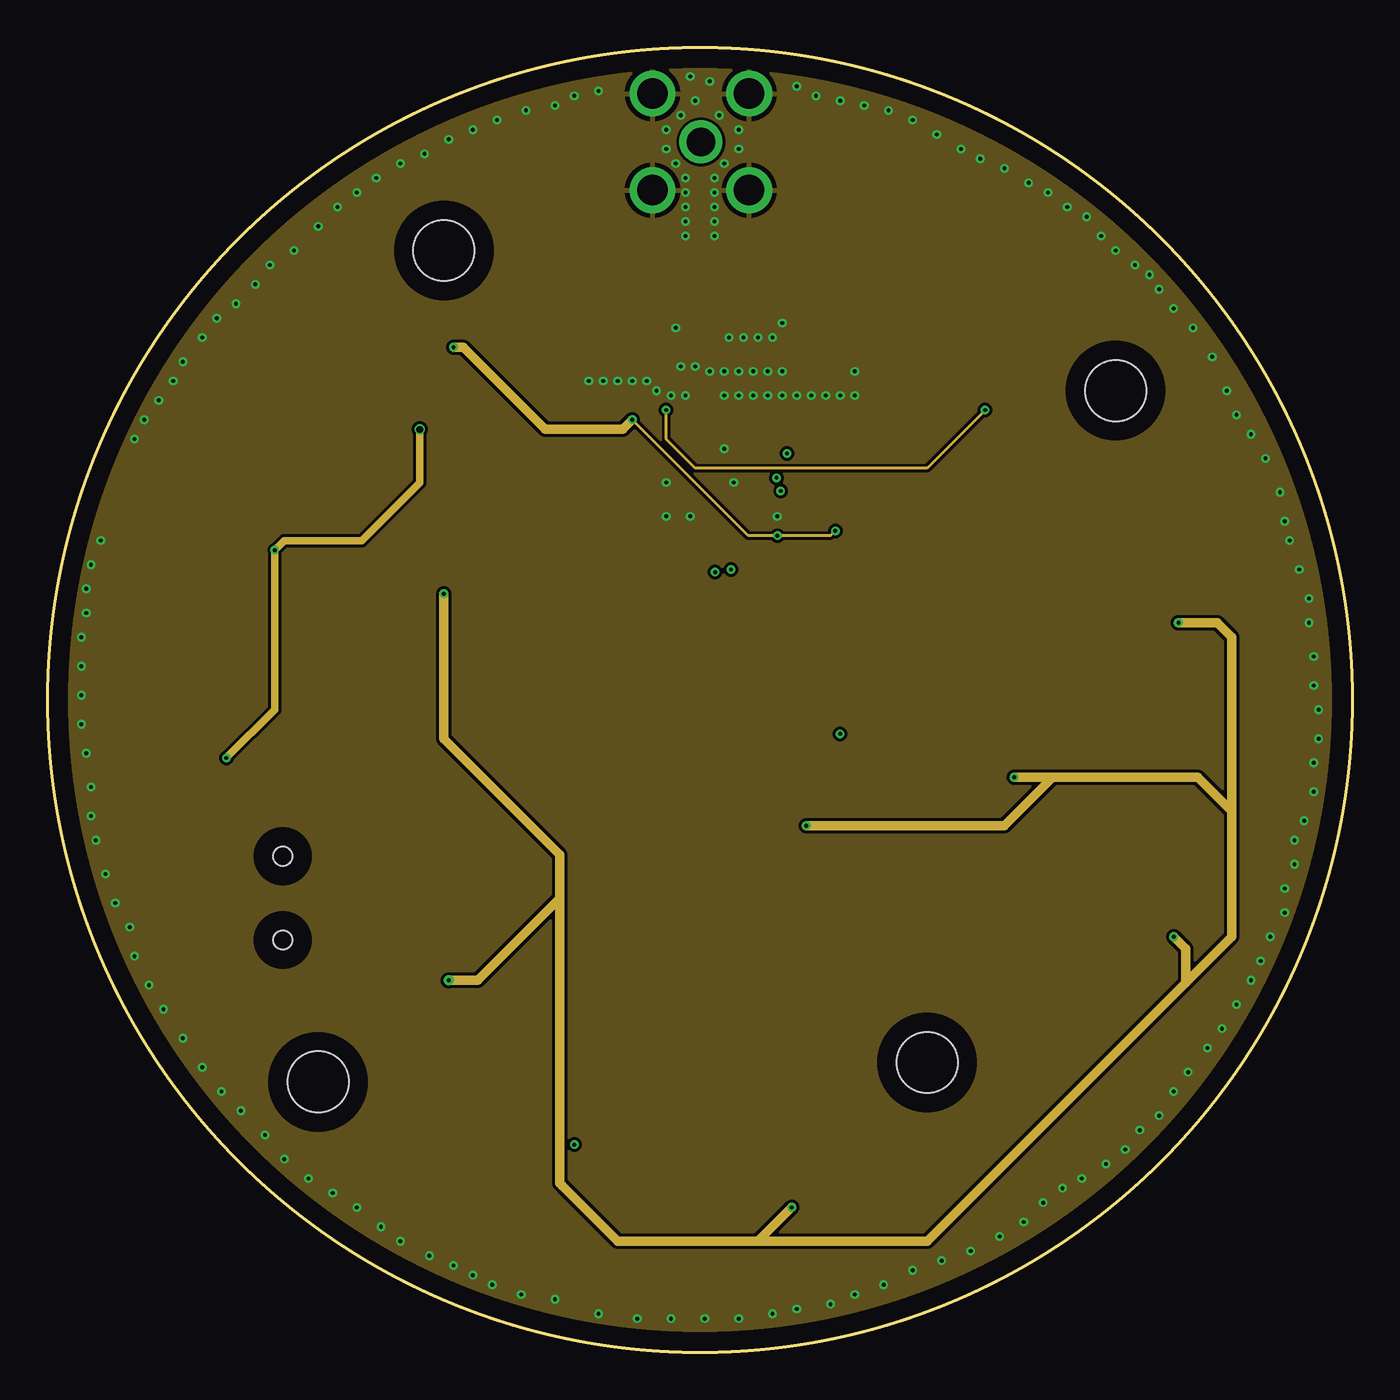
[diagram p7: board, inner layer PWR]
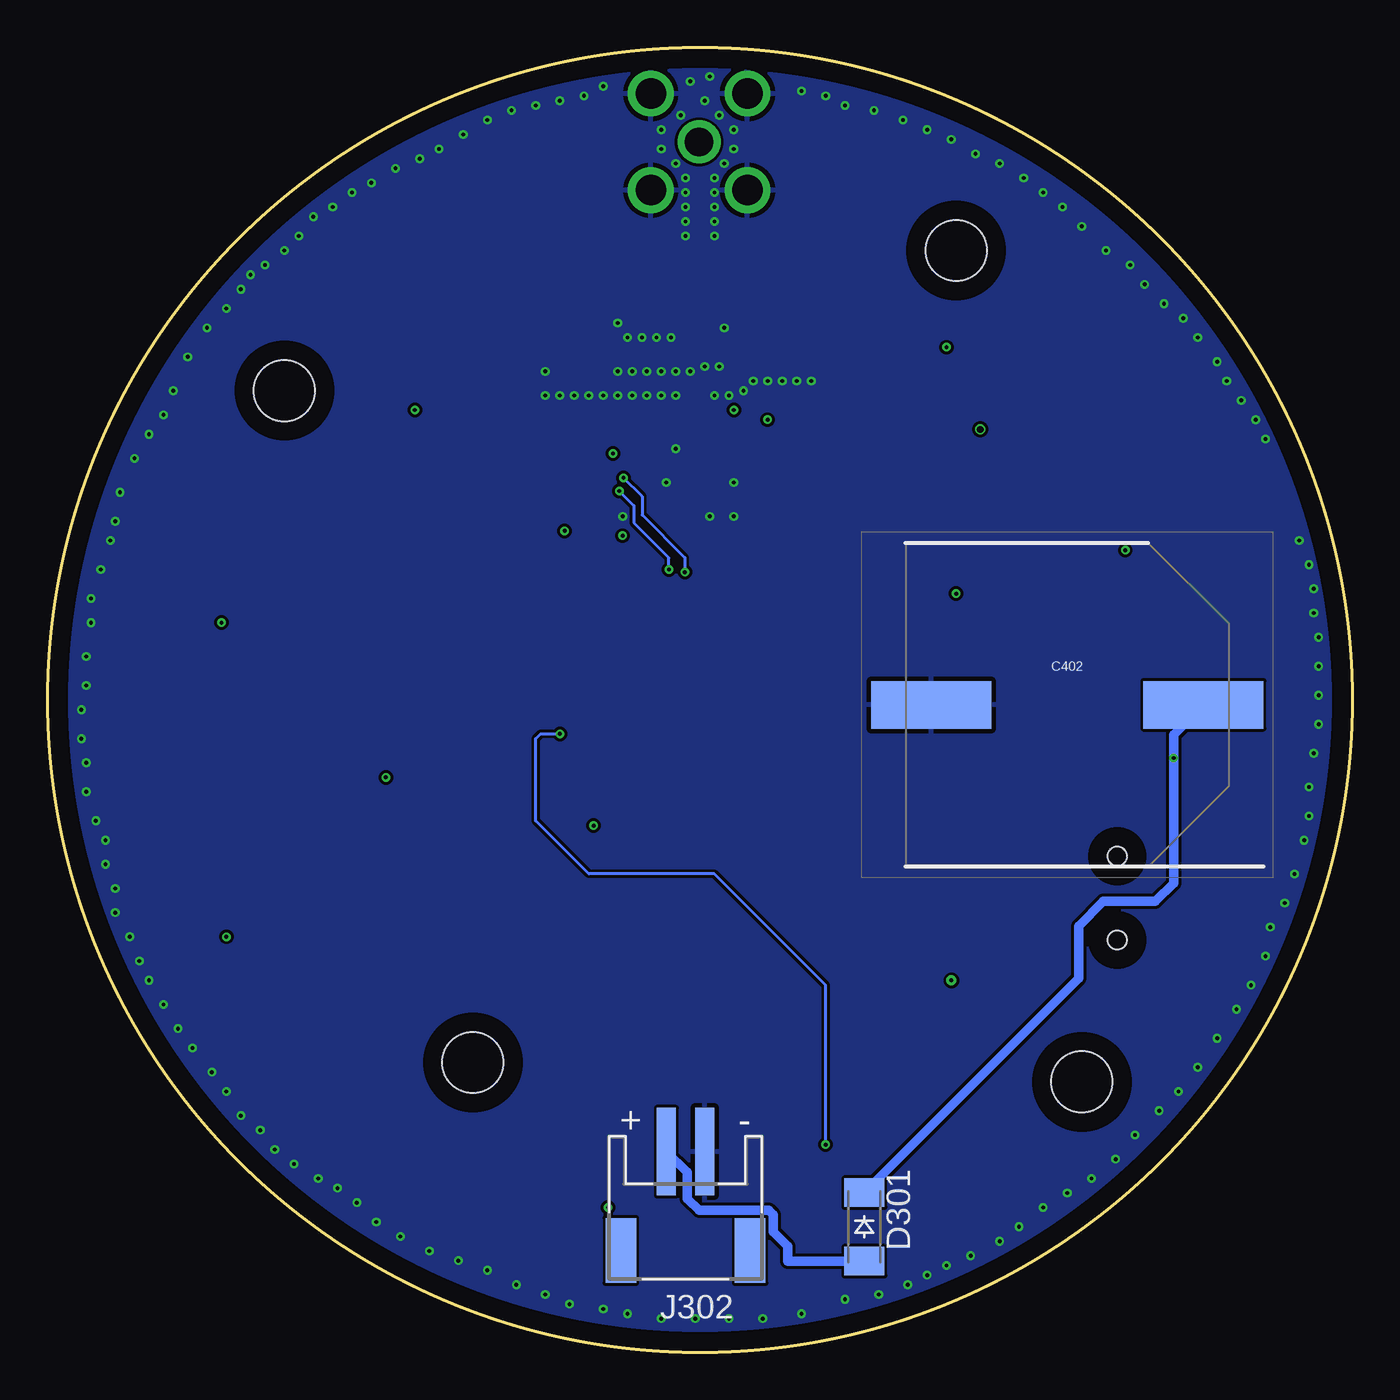
[diagram p8: board, bottom side, seen from below]

Size 68.58 x 68.58 mm. Coordinates in mm from the lower left corner, seen from the top.
Outline: circle at 34.29,34.29 radius 34.29
Copper layers (1+2*15+16): Top 0.035mm / dielectric 0.2mm / GND1 0.0175mm / dielectric 1.065mm / PWR 0.0175mm / dielectric 0.2mm / Bottom 0.035mm
Design rules "default *": minimum track width 3.5mil, minimum drill 0.2mm, track to track 6mil, track to pad 6mil, pad to pad 6mil, via to via 6mil, smd to smd 6mil, copper to edge 40mil, drill to drill 6mil, minimum pad ring 10mil, minimum via ring 3mil, stop-mask expansion 4mil, vias tented up to drill 0mil, thermal gap 10mil
Holes 3.2 mm at 20.83,57.91 56.13,50.55 46.23,15.24 14.22,14.22

### Footprints (pad centres in the part's own frame; a part is rotated, then mirrored left to right if it is on the bottom)
CAPC1608X85N = smd 0.66 x 0.94: 1 -0.711,0; 2 0.711,0
CAPAE1700X1700N = smd 6.3 x 2.5: 1 -7.15,0; 2 7.15,0
SOD-123_MINI-SMA = smd 1.5 x 2.1: A 1.8,0; C -1.8,0
BEADC0603X33N = smd 0.38 x 0.4: 1 -0.281,0; 2 0.281,0
BEADC2012X105N = smd 1.14 x 1.47: 1 -0.89,0; 2 0.89,0
JST-PH-2-SMT-RA = smd 1 x 4.6: 1 1,-3.7; 2 -1,-3.7 | smd 1.6 x 3.4: NC1 -3.4,1.5; NC2 3.4,1.5
JST_B4B-PH-SM4-TB = smd 1 x 5.5: 1 -3,0; 2 -1,0; 3 1,0; 4 3,0 | smd 1.6 x 3: P1 -5.4,2.25; P2 5.4,2.25
2X5_0.05"_SMD_SH = smd 0.5 x 2.5: 1 -2.54,-1.905; 2 -2.54,1.905; 3 -1.27,-1.905; 4 -1.27,1.905; 5 0,-1.905; 6 0,1.905; 7 1.27,-1.905; 8 1.27,1.905; 9 2.54,-1.905; 10 2.54,1.905
SAMTEC_MUSB-05-S-B-SM-A = smd 0.6 x 2.5: 1 -1.6,0; 2 -0.8,0; 3 0,0; 4 0.8,0; 5 1.6,0 | smd 2 x 2.5: 6 -4.45,-0.3; 7 4.45,-0.3; 8 -4.45,-5.75; 9 4.45,-5.75 | hole 1: 2.2,-2.88; -2.2,-2.88
TE_5-1814832-1 = drill 1.5: 1 0,0 | drill 1.6: 2 -2.54,2.54; 3 2.54,2.54; 4 -2.54,-2.54; 5 2.54,-2.54
INDC1608X95 = smd 0.85 x 0.7: 1 -0.775,0; 2 0.775,0
R0603 = smd 1 x 1.1: 1 -0.85,0; 2 0.85,0
QFP50P1200X1200X160-64N = smd 1.47 x 0.25: 1 -5.67,3.75; 2 -5.67,3.25; 3 -5.67,2.75; 4 -5.67,2.25; 5 -5.67,1.75; 6 -5.67,1.25; 7 -5.67,0.75; 8 -5.67,0.25; 9 -5.67,-0.25; 10 -5.67,-0.75; 11 -5.67,-1.25; 12 -5.67,-1.75; 13 -5.67,-2.25; 14 -5.67,-2.75; 15 -5.67,-3.25; 16 -5.67,-3.75; 33 5.67,-3.75; 34 5.67,-3.25; 35 5.67,-2.75; 36 5.67,-2.25; 37 5.67,-1.75; 38 5.67,-1.25; 39 5.67,-0.75; 40 5.67,-0.25; 41 5.67,0.25; 42 5.67,0.75; 43 5.67,1.25; 44 5.67,1.75; 45 5.67,2.25; 46 5.67,2.75; 47 5.67,3.25; 48 5.67,3.75 | smd 0.25 x 1.47: 17 -3.75,-5.67; 18 -3.25,-5.67; 19 -2.75,-5.67; 20 -2.25,-5.67; 21 -1.75,-5.67; 22 -1.25,-5.67; 23 -0.75,-5.67; 24 -0.25,-5.67; 25 0.25,-5.67; 26 0.75,-5.67; 27 1.25,-5.67; 28 1.75,-5.67; 29 2.25,-5.67; 30 2.75,-5.67; 31 3.25,-5.67; 32 3.75,-5.67; 49 3.75,5.67; 50 3.25,5.67; 51 2.75,5.67; 52 2.25,5.67; 53 1.75,5.67; 54 1.25,5.67; 55 0.75,5.67; 56 0.25,5.67; 57 -0.25,5.67; 58 -0.75,5.67; 59 -1.25,5.67; 60 -1.75,5.67; 61 -2.25,5.67; 62 -2.75,5.67; 63 -3.25,5.67; 64 -3.75,5.67
QFN65P600X600X100-29N = smd 0.76 x 0.32: 1 -2.98,1.95; 2 -2.98,1.3; 3 -2.98,0.65; 4 -2.98,0; 5 -2.98,-0.65; 6 -2.98,-1.3; 7 -2.98,-1.95; 15 2.98,-1.95; 16 2.98,-1.3; 17 2.98,-0.65; 18 2.98,0; 19 2.98,0.65; 20 2.98,1.3; 21 2.98,1.95 | smd 0.32 x 0.76: 8 -1.95,-2.98; 9 -1.3,-2.98; 10 -0.65,-2.98; 11 0,-2.98; 12 0.65,-2.98; 13 1.3,-2.98; 14 1.95,-2.98; 22 1.95,2.98; 23 1.3,2.98; 24 0.65,2.98; 25 0,2.98; 26 -0.65,2.98; 27 -1.3,2.98; 28 -1.95,2.98 | smd 4.8 x 4.8: 29 0,0
PEREGRINE_SEMICONDUCTOR_PE4259_0 = smd 0.9 x 0.4: 1 -1.05,0.65; 2 -1.05,0; 3 -1.05,-0.65; 4 1.05,-0.65; 5 1.05,0; 6 1.05,0.65
SOT65P210X110-5N = smd 1.168 x 0.356: 1 -0.889,0.66; 2 -0.889,0; 3 -0.889,-0.66; 4 0.889,-0.66; 5 0.889,0.66
SOT95P280X145-5N = smd 1.22 x 0.6: 1 -1.245,0.95; 2 -1.245,0; 3 -1.245,-0.95; 4 1.245,-0.95; 5 1.245,0.95
QFN50P400X400X100-21N = smd 0.84 x 0.26: 1 -1.935,1; 2 -1.935,0.5; 3 -1.935,0; 4 -1.935,-0.5; 5 -1.935,-1; 11 1.935,-1; 12 1.935,-0.5; 13 1.935,0; 14 1.935,0.5; 15 1.935,1 | smd 0.26 x 0.84: 6 -1,-1.935; 7 -0.5,-1.935; 8 0,-1.935; 9 0.5,-1.935; 10 1,-1.935; 16 1,1.935; 17 0.5,1.935; 18 0,1.935; 19 -0.5,1.935; 20 -1,1.935 | smd 2.7 x 2.7: 21 0,0
NX2016SA32MEXS00ACS06465 = smd 0.85 x 0.75: 1 -0.675,-0.525; 2 0.675,-0.525; 3 0.675,0.525; 4 -0.675,0.525

### Placement (x,y rotation side)
C101  46.99,32.51 270 top
C102  48.77,32.51 270 top
C103  48.77,29.46 90 top
C104  46.99,29.46 90 top
C105  43.43,29.46 90 top
C106  45.21,29.46 90 top
C201  46.99,54.61 270 top
C202  45.21,51.56 90 top
C203  45.22,54.61 270 top
C204  31,52.73 90 top
C205  43.43,51.56 270 top
C206  27.45,52.74 270 top
C207  42.42,56.9 0 top
C208  41.66,54.61 270 top
C209  40.39,52.32 0 top
C210  30.92,55.85 90 top
C211  26.07,47.12 90 top
C212  26.32,44.57 90 top
C213  23.11,49.78 270 top
C214  27.84,47.17 90 top
C215  29.65,47.94 90 top
C216  41.91,47.5 0 top
C217  45.97,45.21 90 top
C218  35.1,56.49 180 top
C301  19.56,40.64 90 top
C302  13.97,40.64 270 top
C303  8.13,45.72 270 top
C304  16.51,44.2 0 top
C401  20.07,24.89 270 top
C402  14.99,34.04 180 bottom
D301  25.65,6.6 270 bottom
FB101  45.14,32.41 0 top
FB201  21.34,49.78 90 top
J301  6.6,37.34 90 top
J302  35.05,6.86 180 bottom
J401  53.34,37.34 270 top
J402  36.07,11.94 180 top
J403  53.34,22.86 270 top
J404  22.61,13.46 270 top
J405  15.24,23.88 270 top
J501  34.34,63.62 0 top
L201  46.99,51.56 90 top
L202  29.22,52.73 90 top
L203  43.43,54.61 90 top
L204  39.62,54.61 270 top
L205  35.05,57.91 180 top
R201  27.43,55.85 90 top
R202  43.69,42.16 180 top
R301  15.75,46.99 90 top
R302  18.03,46.99 270 top
R303  6.14,45.74 90 top
R304  4.06,45.21 90 top
R305  16.51,50.04 180 top
R306  16.51,52.32 0 top
R401  38.1,16.76 0 top
R402  18.03,24.89 90 top
U101  34.29,33.27 180 top
U201  34.29,45.51 0 top
U202  34.4,53.87 90 top
U203  43.43,44.96 90 top
U301  16.76,40.64 270 top
U302  11.43,47.24 180 top
Y201  28.7,44.2 180 top

### Tracks (layer width: path | path; a pad name or v marks a point on that pad's centre or on a via)
ANT_PATH
  Top 0.152: 34.34,57.97 L205.2
  Top 0.33: J501.1 34.34,57.97
GND  (via drill 0.2 pad 0.46)
  Top 0.152: Y201.4 29.15,43.67 28.1,44.72 Y201.2 | U201.26 33.64,47.61 arc-90 33.53,47.5 | U201.16 36.59,44.21 arc90 36.58,44.2
  other vias: 33.53,58.67 33.53,59.44 33.53,60.2 33.53,60.96 33.53,61.72 35.05,61.72 35.05,60.96 35.05,60.2 35.05,59.44 35.05,58.67 35.56,50.29 5.33,19.3 39.37,50.29 36.32,50.29 37.08,50.29 37.85,50.29 38.61,50.29 40.13,50.29 40.89,50.29 41.66,50.29 42.42,50.29 35.56,51.56 36.32,51.56 37.08,51.56 37.85,51.56 38.61,51.56 42.42,51.56 34.8,51.56 33.27,51.82 34.04,51.82 33.53,50.29 32.77,50.29 32,50.55 31.5,51.05 30.73,51.05 29.97,51.05 28.96,66.29 27.69,66.04 26.67,65.53 25.15,65.28 23.62,64.77 22.35,64.26 21.08,63.75 19.81,62.99 18.54,62.48 17.27,61.72 16.26,60.96 15.24,60.2 14.22,59.18 12.95,57.91 11.68,57.15 10.92,56.13 9.91,55.12 8.89,54.36 8.13,53.34 7.11,52.07 6.6,51.05 5.84,50.04 5.08,49.02 33.78,67.06 34.8,66.8 34.04,65.79 33.27,65.02 32.51,64.26 32.51,63.25 33.02,62.48 35.56,62.48 36.32,63.25 36.32,64.26 35.31,65.02 39.37,66.55 40.39,66.04 41.66,65.79 42.93,65.53 32.77,1.78 34.54,1.78 36.32,1.78 38.1,2.03 39.37,2.29 41.15,2.54 42.42,3.05 43.94,3.56 45.47,4.32 46.99,4.83 48.51,5.33 50.04,6.1 51.31,6.86 52.32,7.87 53.34,8.64 54.36,9.14 55.63,9.91 56.64,10.67 57.4,11.68 58.42,12.45 59.18,13.72 59.94,14.73 60.96,16 61.72,17.02 62.48,18.29 63.25,19.56 63.75,20.57 64.26,21.84 65.02,23.11 65.02,24.38 65.53,25.65 65.53,26.92 66.04,27.94 66.55,29.46 66.55,30.99 66.8,32.26 66.8,33.78 66.55,36.58 66.55,35.05 66.29,38.35 66.29,39.62 65.79,41.15 65.28,42.67 65.02,43.69 64.77,45.21 64.01,46.99 63.25,48.26 62.48,49.28 61.98,50.55 61.21,52.32 60.2,53.85 59.18,54.86 58.42,55.88 57.91,56.64 57.15,57.15 56.13,57.91 55.37,58.67 54.61,59.69 53.59,60.2 48.01,63.25 49.02,62.74 50.29,62.23 51.56,61.47 52.58,60.96 46.74,64.01 45.47,64.77 44.2,65.28 30.99,1.78 28.96,2.03 26.67,2.79 24.89,3.05 23.37,3.56 22.35,4.06 21.34,4.57 20.07,5.08 18.54,5.84 17.53,6.6 16.26,7.62 14.99,8.38 13.72,9.14 12.45,10.16 11.43,11.43 10.16,12.7 9.14,13.72 8.13,14.99 7.11,16.51 6.1,18.03 4.57,20.83 4.32,22.35 3.56,23.62 3.05,25.15 2.54,26.92 2.29,28.19 2.29,29.72 2.03,31.5 1.78,33.02 1.78,34.54 1.78,36.07 1.78,37.59 2.03,38.86 2.03,40.13 4.57,48.01 2.79,42.67 2.29,41.4 35.81,53.34 36.58,53.34 37.34,53.34 38.1,53.34 38.61,54.1 33.02,53.85 29.21,51.05 28.45,51.05 38.35,43.94 32.51,43.94 33.78,43.94 35.56,47.5 36.07,45.72 32.51,45.72
  pour GND1: 48.01,69.85 19.81,69.85 -1.27,48.77 -1.27,20.07 20.32,-1.52 48.26,-1.52 70.1,20.32 70.1,47.75
  pour Top (isolate 0.254): 25.65,65.28 25.65,50.29 27.43,48.51 48.26,48.51 48.26,62.99 44.96,66.29 26.67,66.29
  pour Top (rank 2): 48.01,69.85 19.81,69.85 -1.27,48.77 -1.27,20.07 20.32,-1.52 48.26,-1.52 70.1,20.32 70.1,47.75
  pour Bottom: 47.5,69.85 19.3,69.85 -1.78,48.77 -1.78,20.07 19.81,-1.52 47.75,-1.52 69.6,20.32 69.6,47.75
  pour PWR: 47.75,70.1 19.56,70.1 -1.52,49.02 -1.52,20.32 20.07,-1.27 48.01,-1.27 69.85,20.57 69.85,48.01
MCU_SWCLK
  Top 0.152: J404.4 26.67,14.73 30.54,18.6 U101.49
MCU_SWDIO
  Top 0.152: J404.2 24.51,28.32 26.71,30.52 U101.46
MOIST_ANA
  Top 0.152: J401.3 53.15,36.52 U101.15
N$1
  Top 0.152: C214.1 29.74,46.46 30.04,46.16 U201.3
N$2
  Top 0.152: C215.1 29.99,47.23 30.48,46.74 31.23,46.74 U201.2
N$3
  Top 0.152: C211.1 26.48,46.41 27.18,45.72 28.7,45.72 29.38,45.05 Y201.1 30.12,45.47 31.26,45.47 U201.4
N$4
  Top 0.152: R302.2 R301.1 15.07,46.14 14.47,46.74 U302.2
N$5
  Top 0.152: C206.1 27.5,53.51 | R201.1 27.45,54.98
  Top 0.33: 27.5,53.51 L202.2 | 27.45,54.98 C206.1
N$6
  Top 0.152: U302.12 5.49,47.74 4.06,46.32 R304.2
N$7
  Top 0.152: 27.57,56.56 R201.2
  Top 0.33: C210.2 27.57,56.56
N$8
  Top 0.152: U302.13 6.79,47.24 R303.2
N$9
  Top 0.152: J405.1 17.77,25.48 R402.2
N$10
  Top 0.152: C212.1 27.84,43.86 Y201.3 28.21,43.67 28.96,42.93 29.75,42.93 30.48,43.65 30.48,44.45 30.89,44.87 U201.5
N$11
  Top 0.152: U302.16 10.41,45.31 | 10.41,45.31 9.81,45.31 9.4,45.72 9.4,46.15 U302.15 | U302.14 U302.15 | U302.15 8.31,46.24 C303.1 | 10.3,45.2 10.41,45.31
  Top 0.508: J301.1 10.3,45.2
N$12
  Top 0.152: R306.2 R305.1
N$13
  Top 0.152: U302.5 15.16,50.04 R305.2
N$14
  Top 0.33: C205.1 L203.1
N$15
  Top 0.152: L203.2 43.37,55.32 | 39.69,55.32 L204.1 | 41.66,56.84 C207.1
  Top 0.33: 43.37,55.32 C208.1 | C208.1 39.69,55.32 | C208.1 41.66,56.84
N$19
  Top 0.152: 43.43,43.64 U203.2 43.43,43.52 42.84,42.93 R202.2
N$20
  Top 0.152: U202.5
  Top 0.33: U202.5 C218.2
N$21
  Top 0.152: 35.81,57.9 L205.1
  Top 0.33: C218.1 35.81,57.9
N$22  (via drill 0.2 pad 0.45)
  other vias: 38.86,47.24
N$23
  Bottom 0.508: D301.A 29.68,4.8 29.68,5.59 30.45,6.35 30.45,7.23 30.68,7.46 34.33,7.46 34.96,8.09 34.96,9.46 J302.1
NRST  (via drill 0.2 pad 0.45)
  Top 0.152: J404.10 v27.69,10.92 | v41.66,32.51 39.97,32.51 U101.7
  Bottom 0.152: v27.69,10.92 27.69,19.3 33.53,25.15 40.13,25.15 42.93,27.94 42.93,32.26 42.67,32.51 v41.66,32.51
OW_RX/TX
  Top 0.152: J402.2 37.07,16.58 R401.1 33.04,20.97 33.04,27.43 | 33.04,27.43 U101.54 | U101.53 32.87,27.6 33.04,27.43
PB8
  Top 0.152: U101.61 36.58,27.57 36.58,26.16 38.61,24.13 53.07,24.13 J403.2
PB9
  Top 0.152: U101.62 37.08,27.56 37.08,26.42 38.86,24.64 47.75,24.64 49.02,25.91 53.29,25.91 J403.1
RADIO_DIO0
  Top 0.152: U201.9 32.99,38.99 U101.27
RADIO_DIO1
  Top 0.152: U201.10 33.64,39.04 U101.26
RADIO_DIO2
  Top 0.152: U201.11 34.04,42.28 U101.25
RADIO_DIO3
  Top 0.152: U201.12 34.68,42.27 34.68,42.06 34.54,41.92 U101.24
RADIO_MISO  (via drill 0.2 pad 0.45)
  Top 0.152: U101.22 35.54,40.74 35.76,40.96 35.76,40.98 v35.92,41.15 | U201.18 38.29,45.51 v38.53,45.27
  Bottom 0.152: v35.92,41.15 35.92,41.77 37.77,43.61 37.77,44.51 v38.53,45.27
RADIO_MOSI  (via drill 0.2 pad 0.45)
  Top 0.152: U101.23 35.04,40.96 v35.09,41.01 | U201.19 38.12,46.16 v38.31,45.96
  Bottom 0.152: v35.09,41.01 35.09,41.77 37.34,44.02 37.34,44.99 v38.31,45.96
RADIO_NSS
  Top 0.152: U101.20 36.69,39.09 36.69,39.76 39.49,42.56 39.49,45.85 38.53,46.81 U201.20
RADIO_SCK
  Top 0.152: U101.21 36.04,39.86 38.89,42.72 38.89,44.21 38.25,44.86 U201.17
RF_RX
  Top 0.152: C210.1 30.97,55.14
  Top 0.33: 30.97,55.14 arc-90 32.26,53.85 arc90 33.28,52.82 U202.1
RF_TX
  Top 0.152: L204.2 39.67,53.78 | C208.2 41.59,53.84 | 39.43,52.57 C209.1
  Top 0.33: 39.67,53.78 C209.1 | 41.59,53.84 L204.2 | U202.3 arc90 35.05,52.57 39.43,52.57
RFI
  Top 0.152: L202.1 29.28,52.02
  Top 0.33: 29.28,52.02 C204.1 32.35,52.02 arc-90 32.51,51.86 32.51,51.31 arc90 32.77,51.05 34.04,51.05 arc-90 34.29,50.8 U201.25
RFO
  Top 0.152: L201.1 46.93,50.85 | 37.3,50.85 arc90 37.3,50.85
  Top 0.33: 46.93,50.85 C202.1 C205.2 37.3,50.85 | U201.24 34.94,50.53 arc-90 35.26,50.85 37.3,50.85
RXTX_INV
  Top 0.152: C217.2 45.97,45.94 | U202.4 35.1,54.86 36.58,54.86 40.39,58.67 46.48,58.67 50.29,54.86 50.29,49.09 47.19,45.99 46.04,45.99 C217.2 | C217.2 44.09,45.92 U203.4
RXTX_SEL
  Top 0.152: U201.23 35.56,48.52 35.56,49.02 35.81,49.28 38.3,49.28 40.89,46.68 40.89,42.67 42.42,41.15 43.52,41.15 R202.1
V_ANA
  Top 0.152: FB101.1 44.85,30.53 C106.2 C105.2 42.37,30.18 41.66,29.46 40.02,29.46 U101.1 39.9,29.46
  Top 0.33: U101.13 38.83,35.52 38.1,34.8 38.1,30.23 38.86,29.46 39.9,29.46
V_EXT  (via drill 0.2 pad 0.45, 0.35)
  Top 0.152: C401.2 18.17,24.18 R402.1 18.03,24.37 18.81,25.15 18.81,28.11 16.27,30.65 10.04,30.65 9.45,31.24 v9.4,31.24 | R301.2 15.65,47.74 | U302.9 10.95,49.2 10.95,49.78 12.23,51.07 16,51.07 16.39,50.68 16.39,49.39 15.75,48.75 R301.2 | R301.2 16.09,47.84 17.27,49.02 19.05,49.02 v19.56,48.51
  Top 0.254: U302.17 U302.18 U302.19 | U302.4 U302.3
  Top 0.33: 15.65,47.74 U302.4
  Top 0.406: U302.17 10.93,44.8 11.94,43.79 v11.94,42.16
  PWR 0.406: v9.4,31.24 11.94,33.78 v11.94,42.16 12.45,42.67 16.51,42.67 19.56,45.72 v19.56,48.51
  Bottom 0.508: C402.1 9.4,32.47 v9.4,31.24 9.4,24.66 10.36,23.7 13.09,23.7 14.38,22.41 14.38,19.67 D301.C
V_MCU  (via drill 0.2 pad 0.45, 0.2 pad 0.51)
  Top 0.152: C104.2 46.99,31.75 | 46.99,31.75 C101.2 46.38,32.41 FB101.2 | 46.99,31.75 48.72,31.75 C102.2 48.77,30.23 | 48.77,30.23 C103.2 C104.2 | C104.2 | R401.2 39.07,16.65 J402.1 39.12,11.89 | C301.1 19.61,39.88 | 59.42,38.34 v59.44,38.35 | 59.17,21.86 v59.18,21.84 | v50.8,30.23 48.77,30.23 | v39.88,27.69 39.8,27.6 | U101.32 30.55,38.02 30.84,37.73 36.49,37.73 37.05,38.29 37.05,38.93 U101.19
  Top 0.33: 39.8,27.6 U101.64 | U101.32 27.32,42.16 21.59,42.16 20.83,41.4
  Top 0.508: U301.5 18.25,39.93 C301.1 | 19.61,39.88 v20.83,39.88 20.83,41.4 20.83,46.48 21.34,46.99 FB201.1 | J401.2 59.42,38.34 | 39.12,11.89 v39.12,7.62 | J403.3 59.17,21.86 | v21.08,19.56 21.08,16.38 J404.1
  PWR 0.152: 37.34,5.84 37.08,5.84 | 26.92,8.89 27.05,8.76
  PWR 0.508: 59.82,19.43 46.23,5.84 37.08,5.84 29.97,5.84 27.05,8.76 | 59.82,19.43 62.23,21.84 62.23,28.45 | 62.23,28.45 62.23,37.59 61.47,38.35 v59.44,38.35 | v59.18,21.84 59.82,21.21 59.82,19.43 | v39.12,7.62 37.34,5.84 | 62.23,28.45 60.45,30.23 52.83,30.23 | 52.83,30.23 v50.8,30.23 | 52.83,30.23 50.29,27.69 v39.88,27.69 | v20.83,39.88 20.83,32.26 26.92,26.16 26.92,23.88 | 26.92,23.88 22.61,19.56 v21.08,19.56 | 26.92,23.88 26.92,8.89
V_RF  (via drill 0.2 pad 0.45)
  Top 0.152: 21.52,50.49 FB201.2 | U203.5 42.88,45.95 42.88,47.24 C216.2 41.86,46.74 41.86,43.64 v41.4,43.18 | 23.29,50.67 C213.1 | v30.73,49.02 30.48,48.77 30.48,47.72 30.73,47.46 U201.1 | U201.15 37.97,43.56 38.35,43.18 v38.35,42.93 | U202.6 30.76,57.91 23.88,57.91 23.52,57.56 23.52,56.8 21.34,54.61 v21.34,52.83
  Top 0.33: C213.1 21.52,50.49
  Top 0.508: FB201.2 v21.34,52.83
  PWR 0.152: v30.73,49.02 36.83,42.93 v38.35,42.93 41.15,42.93 v41.4,43.18
  PWR 0.508: v21.34,52.83 21.84,52.83 26.16,48.51 30.23,48.51 v30.73,49.02
V_SYS
  Top 0.152: U302.20 12.59,45.47 12.95,45.47 13.36,45.88 13.36,46.23 | 13.36,46.23 U302.1 | 15.8,41.9 U301.3 | 17.71,42.28 U301.1 | 13.77,46.23 13.36,46.23
  Top 0.33: 17.71,42.28 C304.1 13.77,46.23
  Top 0.508: U301.3 15.28,41.35 C302.1 | C304.1 15.8,41.9
VR_PA  (via drill 0.2 pad 0.45)
  Top 0.152: L201.2 48.25,52.34 49.28,51.31 v49.28,49.53 | v32.51,49.53 32.34,49.36 U201.28
  Top 0.33: C203.2 C201.2 L201.2
  PWR 0.152: v49.28,49.53 46.23,46.48 34.04,46.48 32.51,48.01 v32.51,49.53

### Text on the board
tNames: Capstone PCB / XYZ Company / S. Spencer / E. Fryters